# EAGLE design EIT sample circuit with shorter connectors (EAGLE 7.7.0)
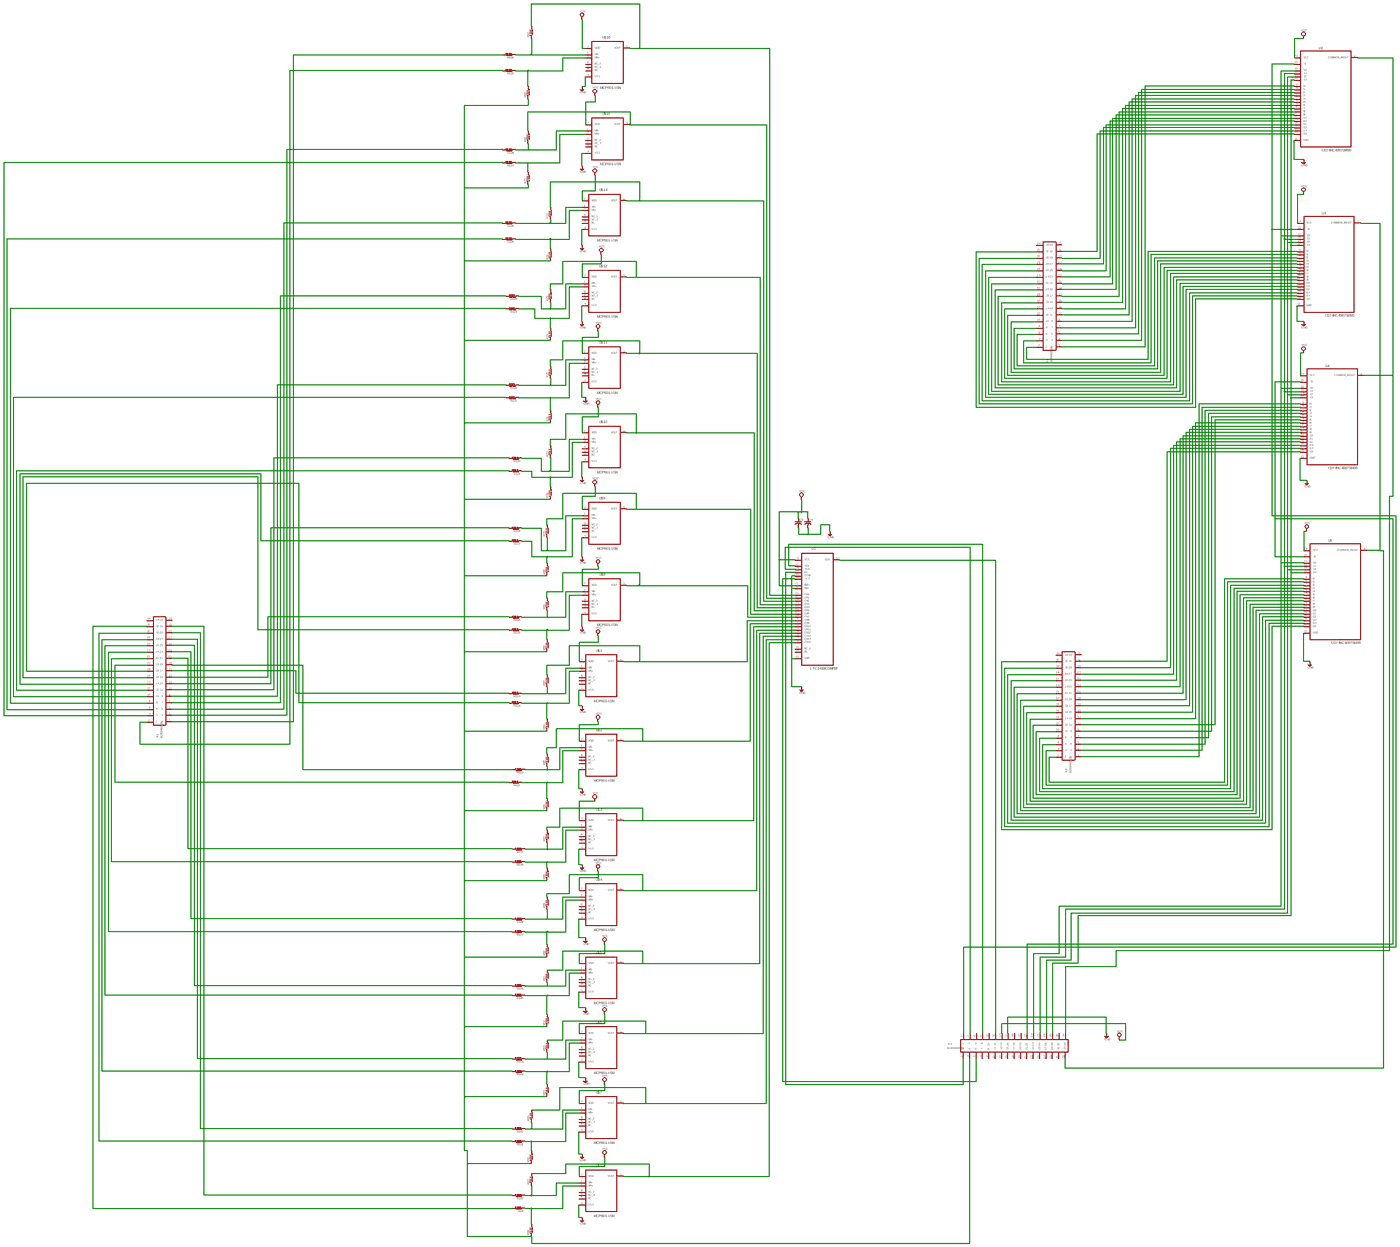
[diagram p0: schematic, sheet 1, overview]
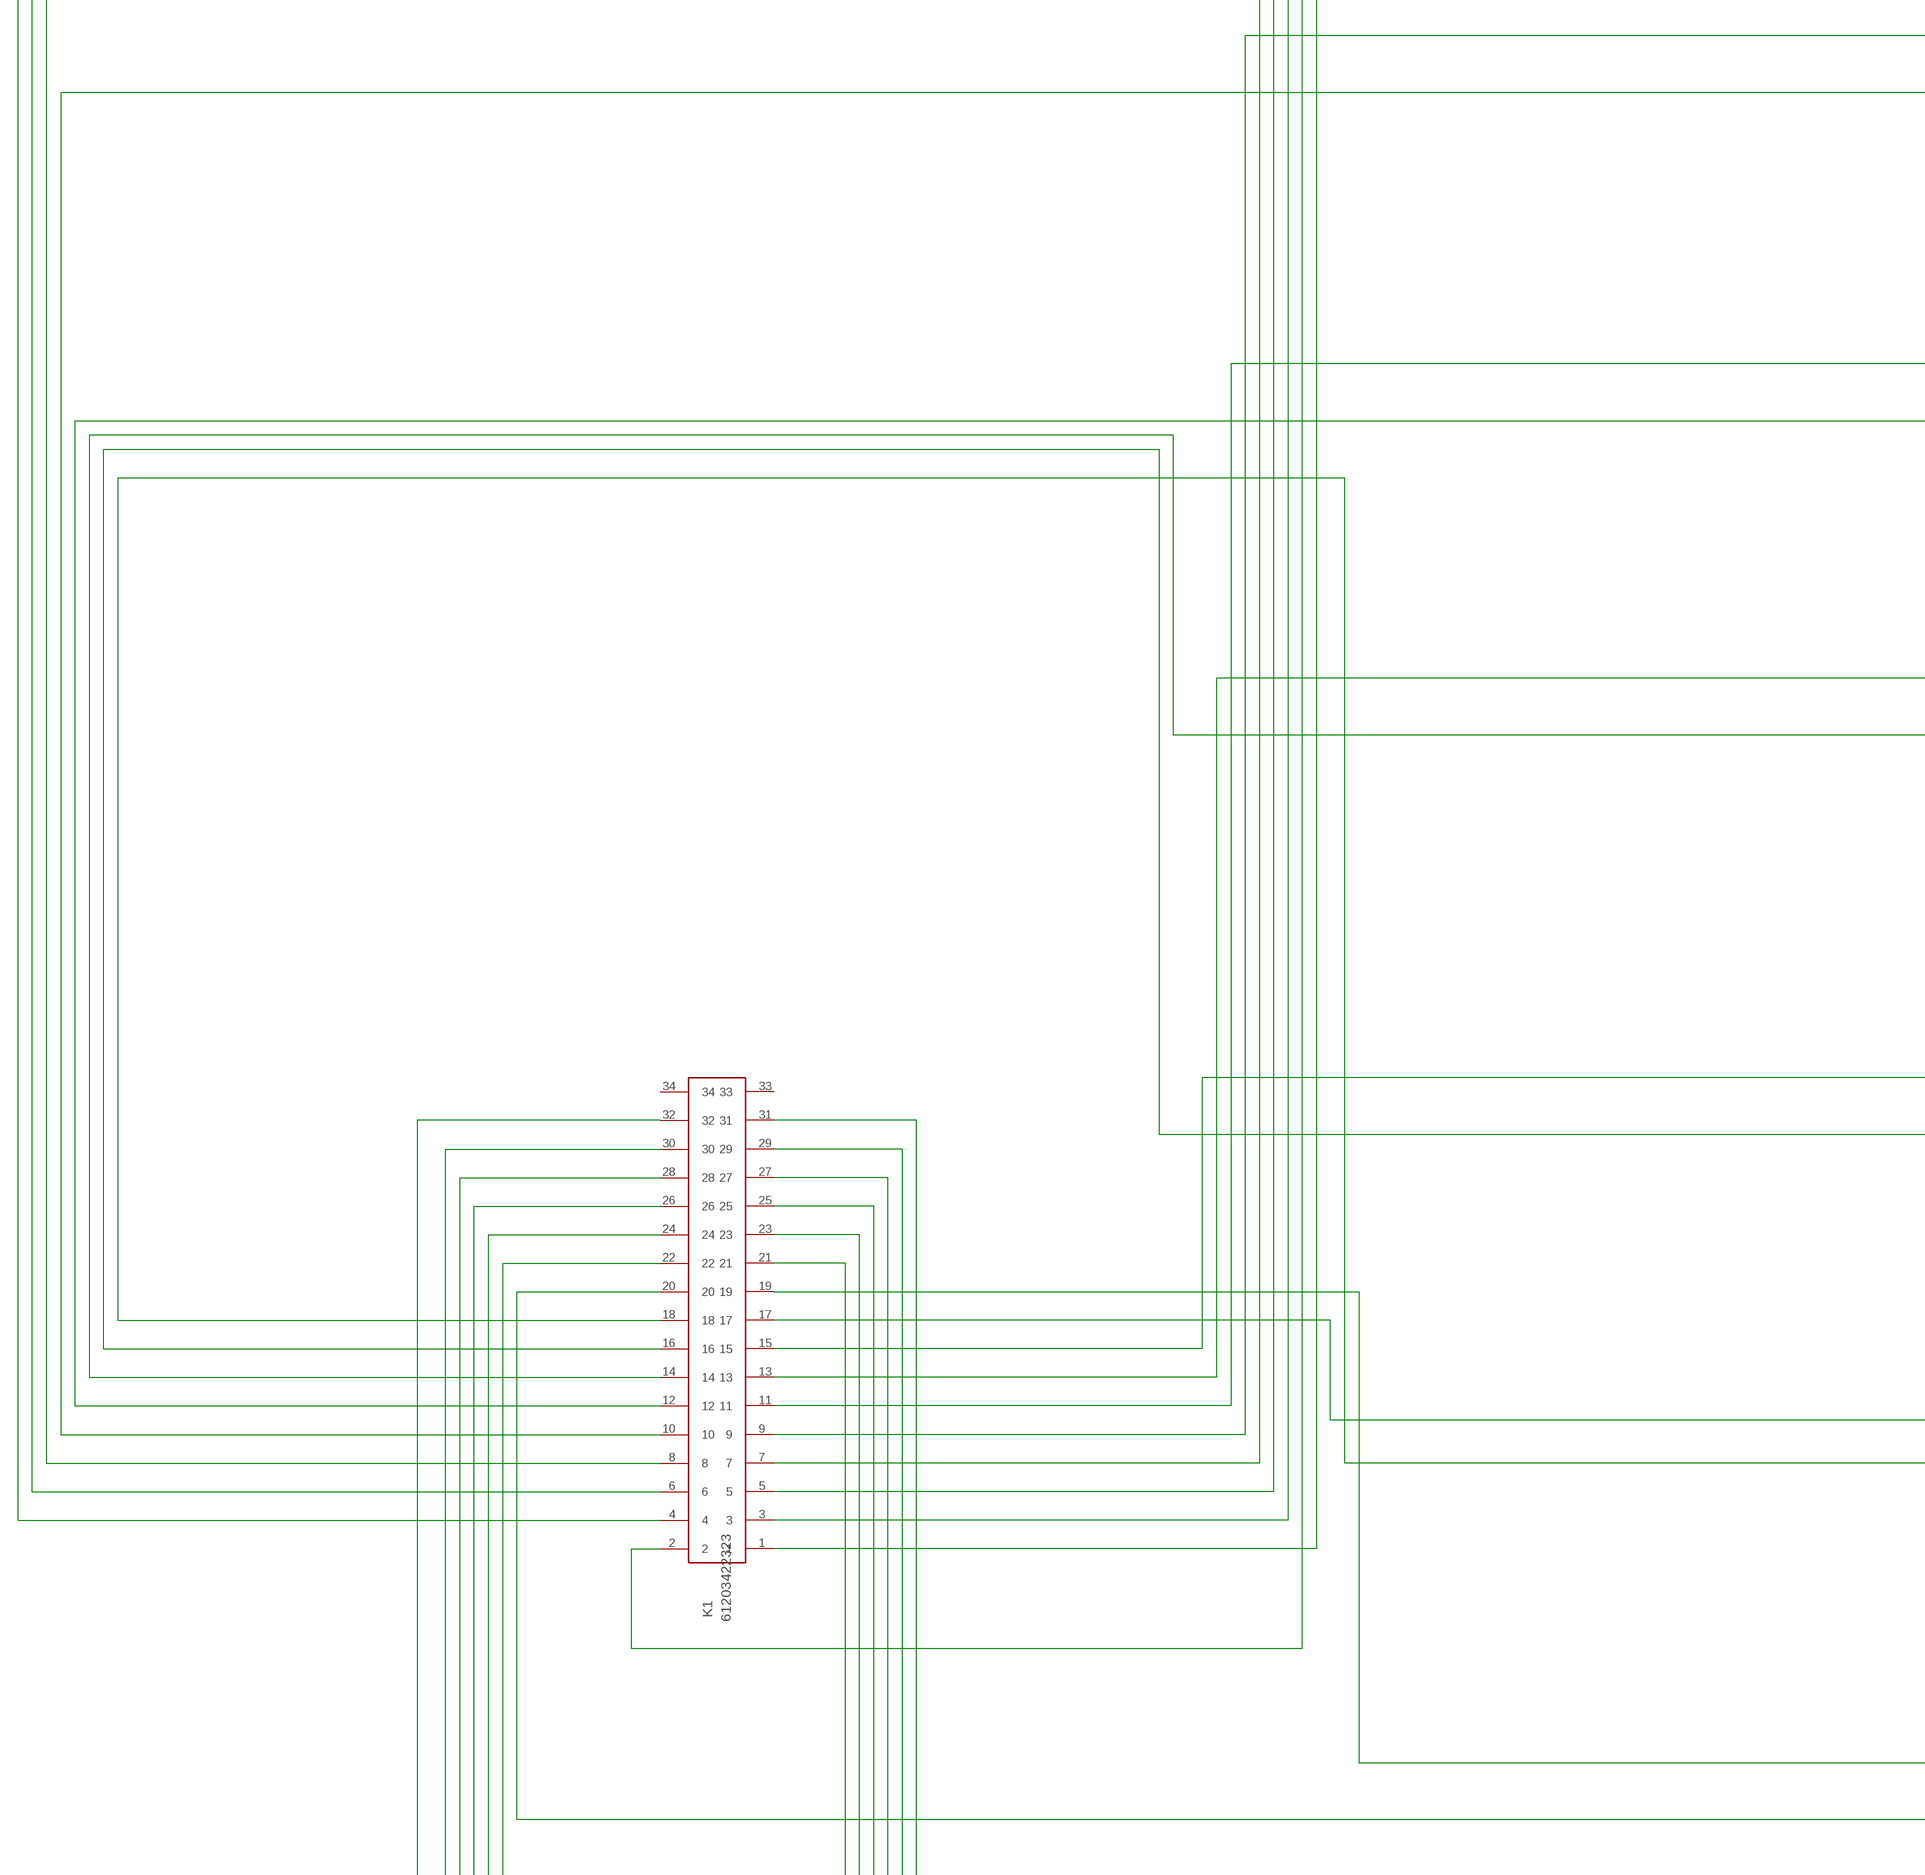
[diagram p1: schematic, sheet 1, part 1 of 7]
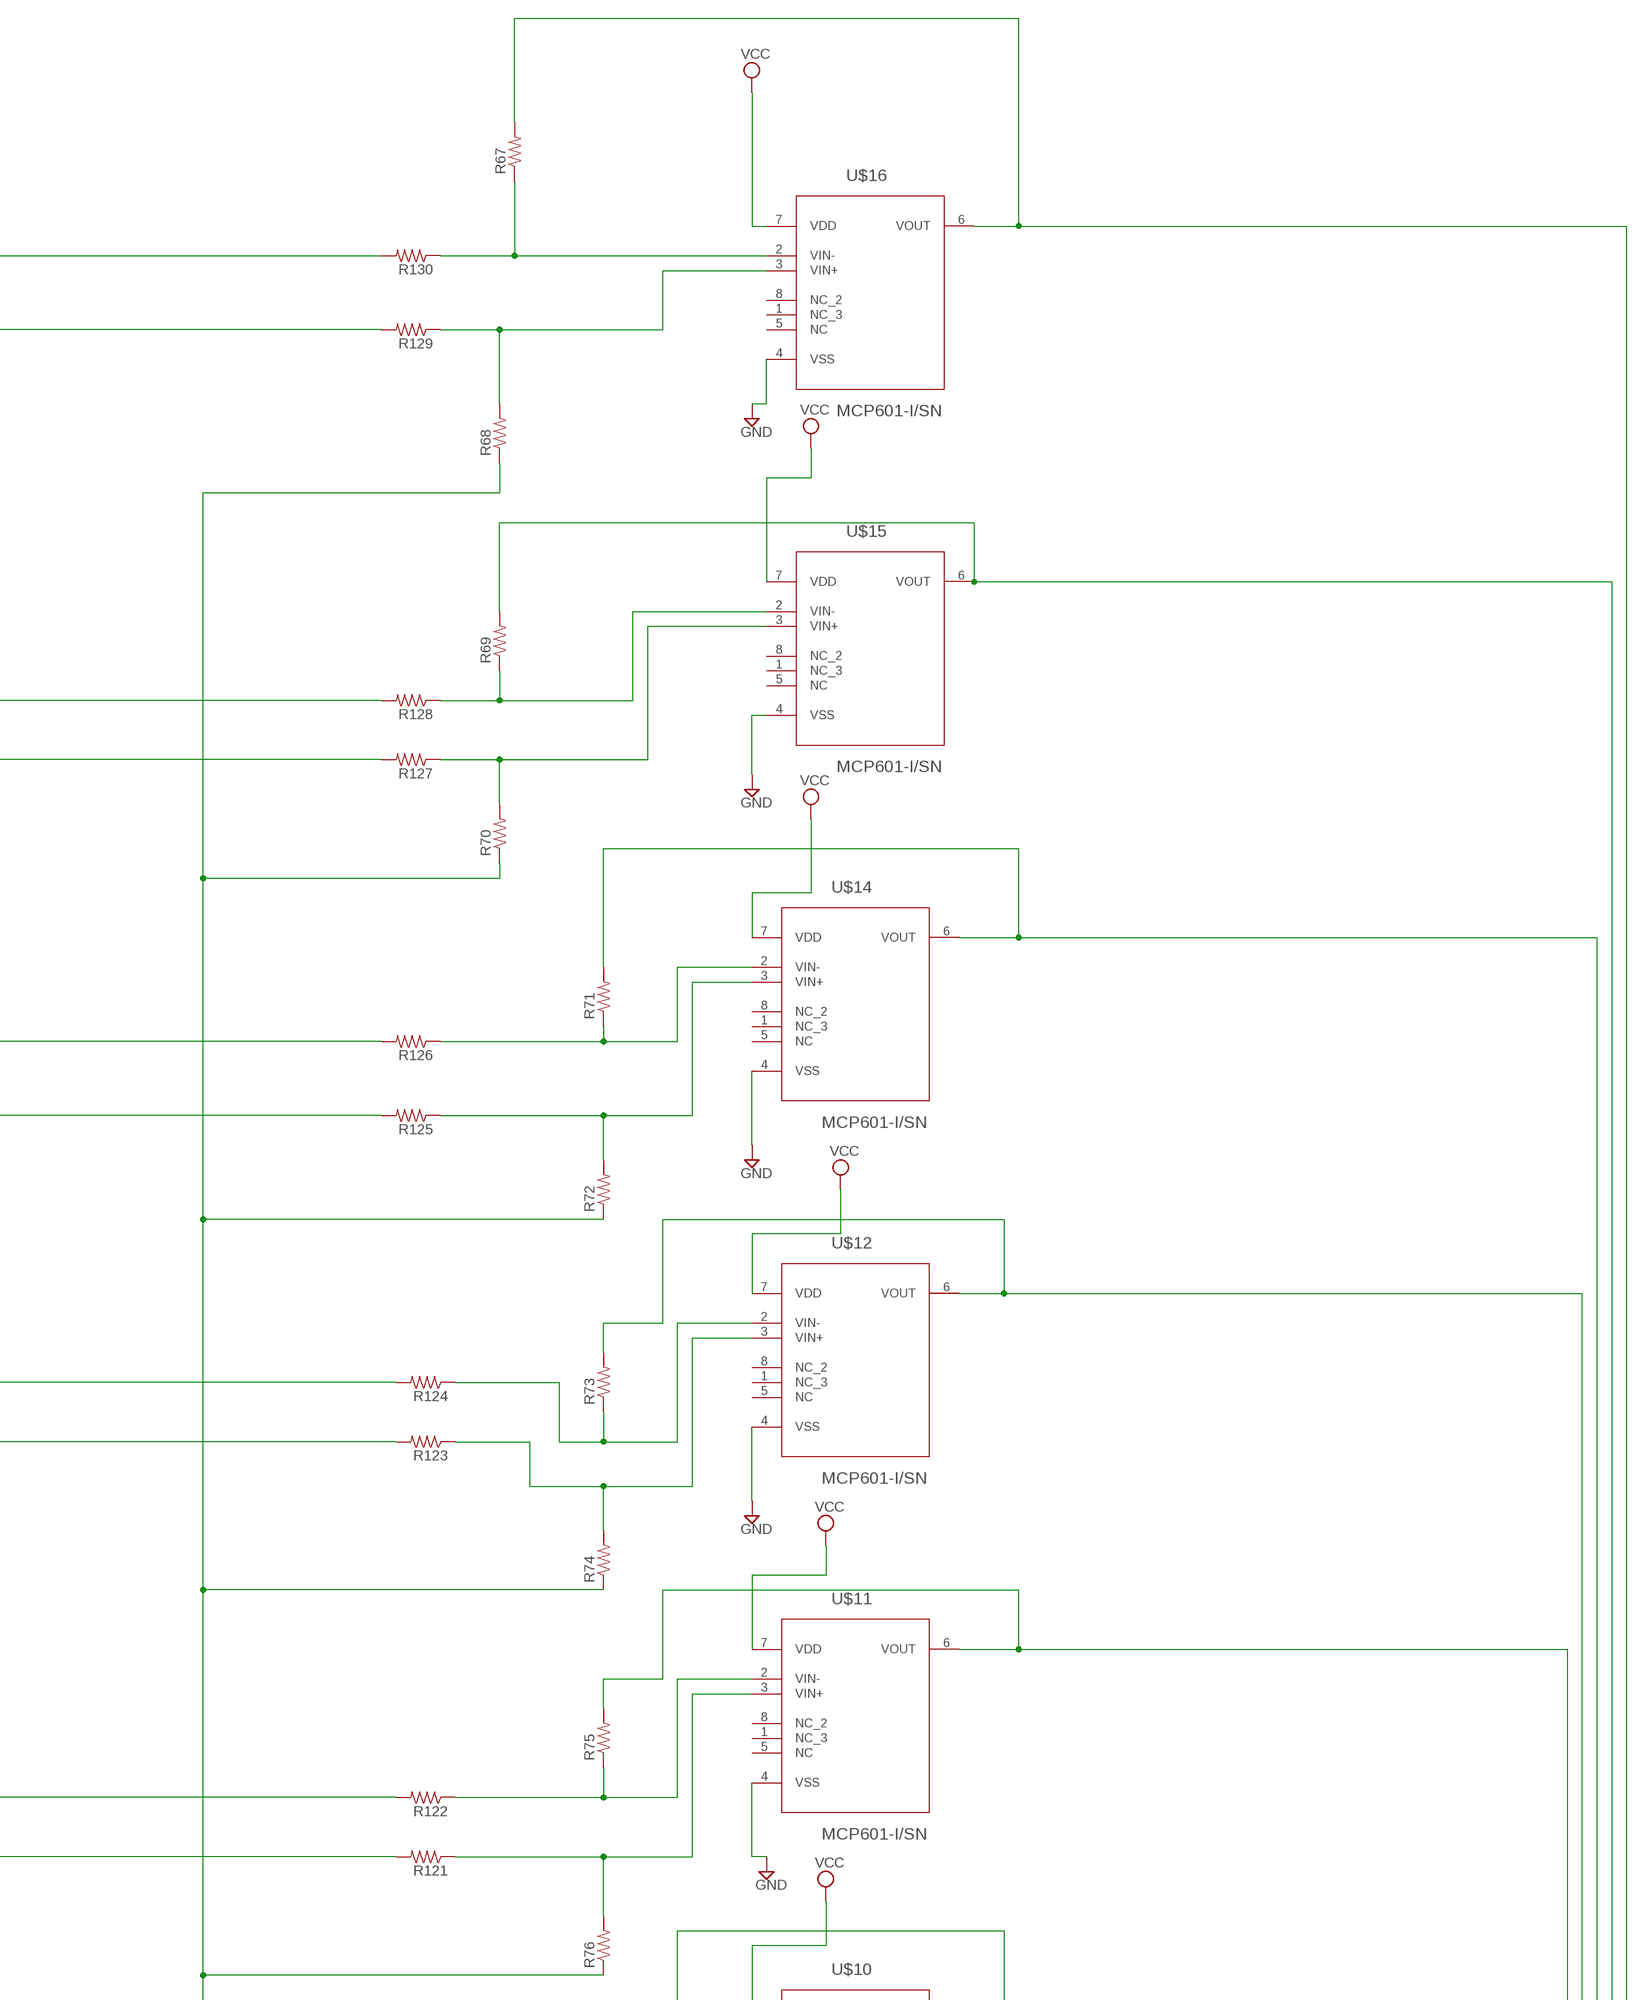
[diagram p2: schematic, sheet 1, part 2 of 7]
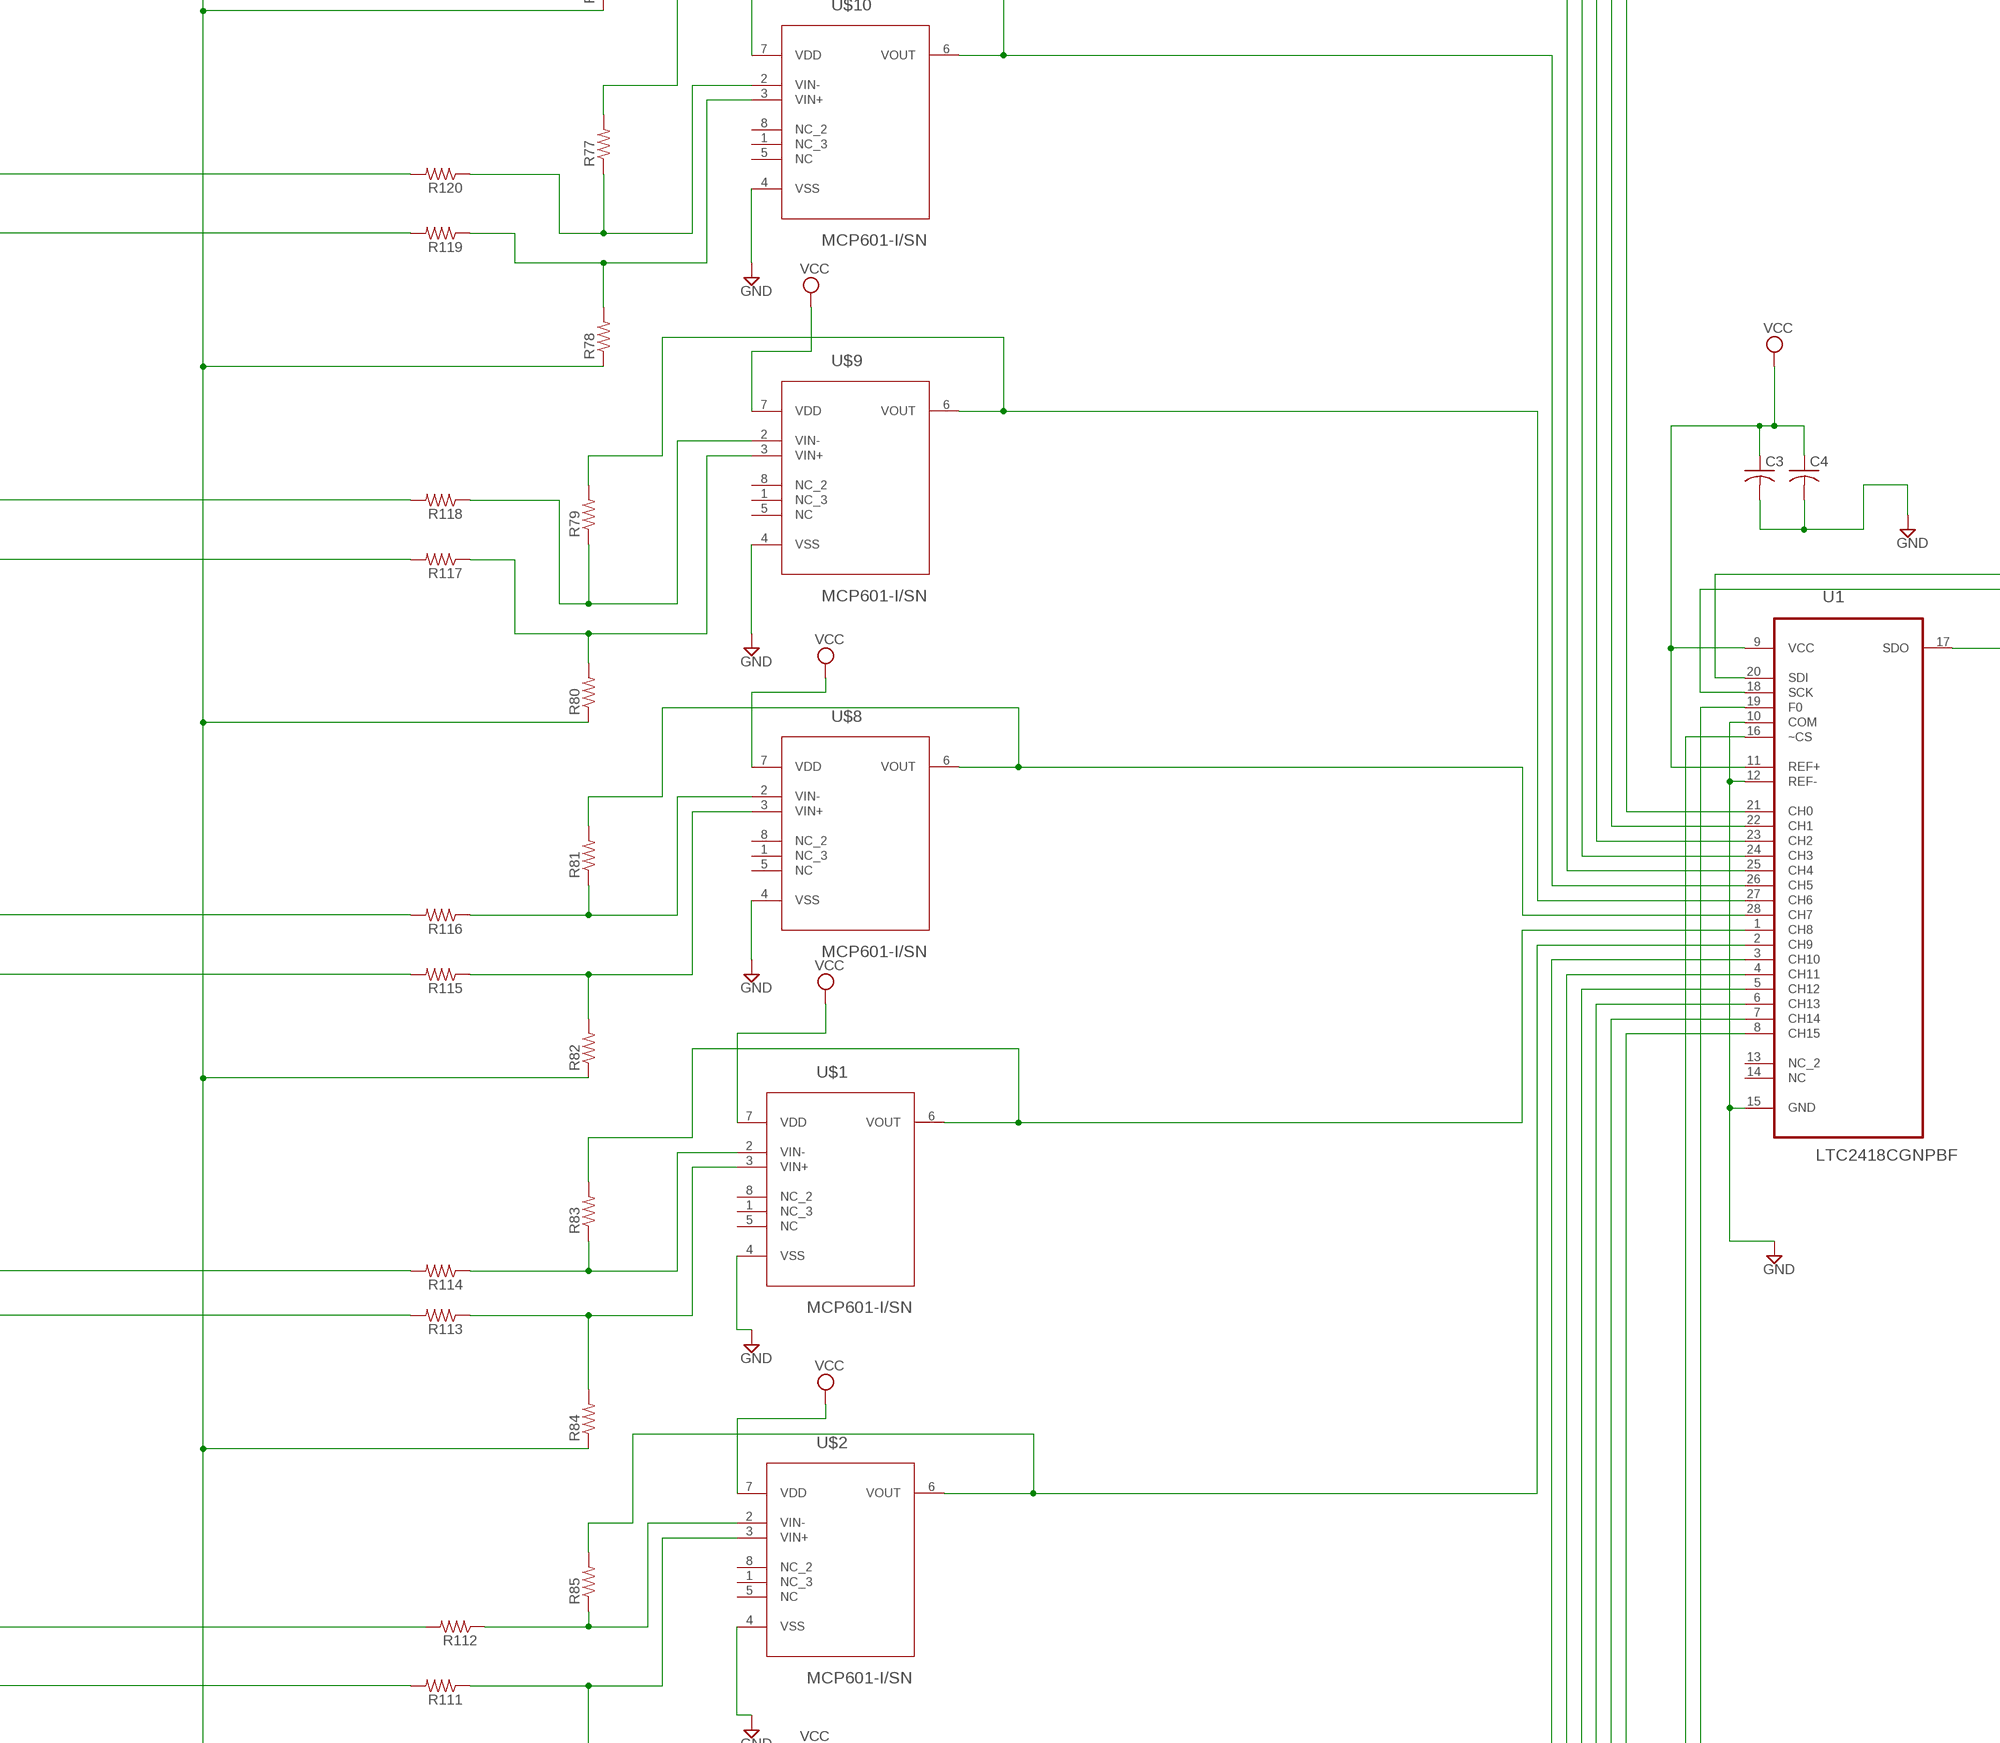
[diagram p3: schematic, sheet 1, part 3 of 7]
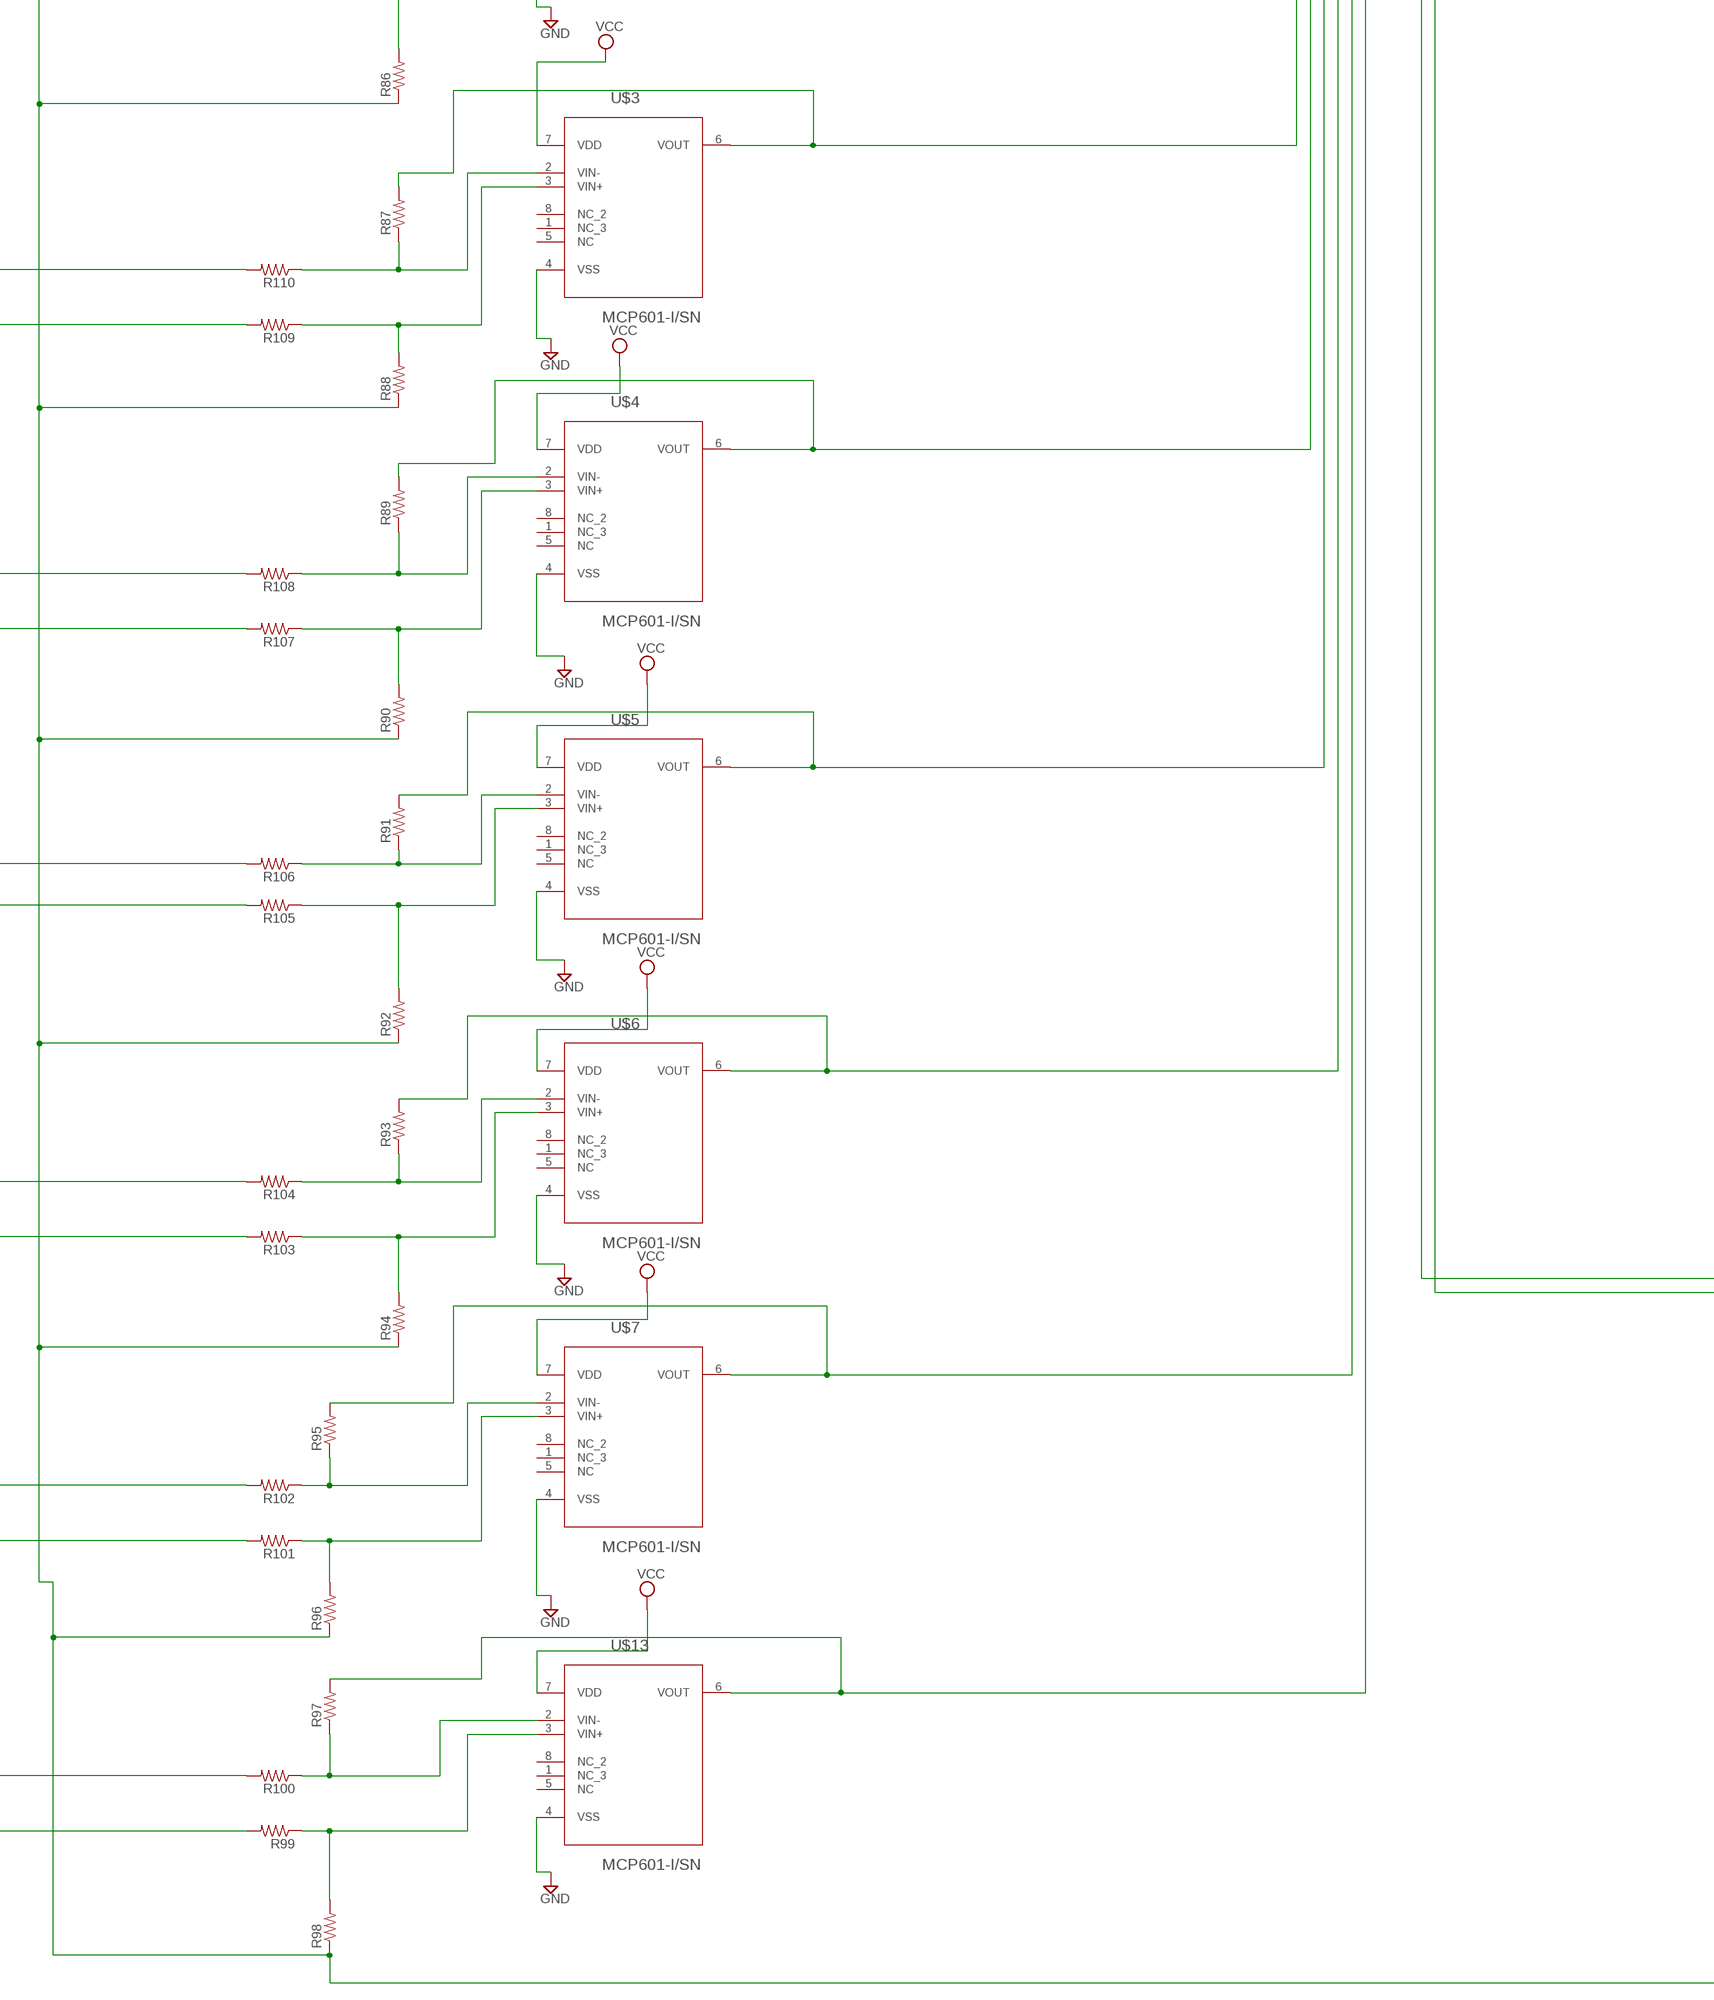
[diagram p4: schematic, sheet 1, part 4 of 7]
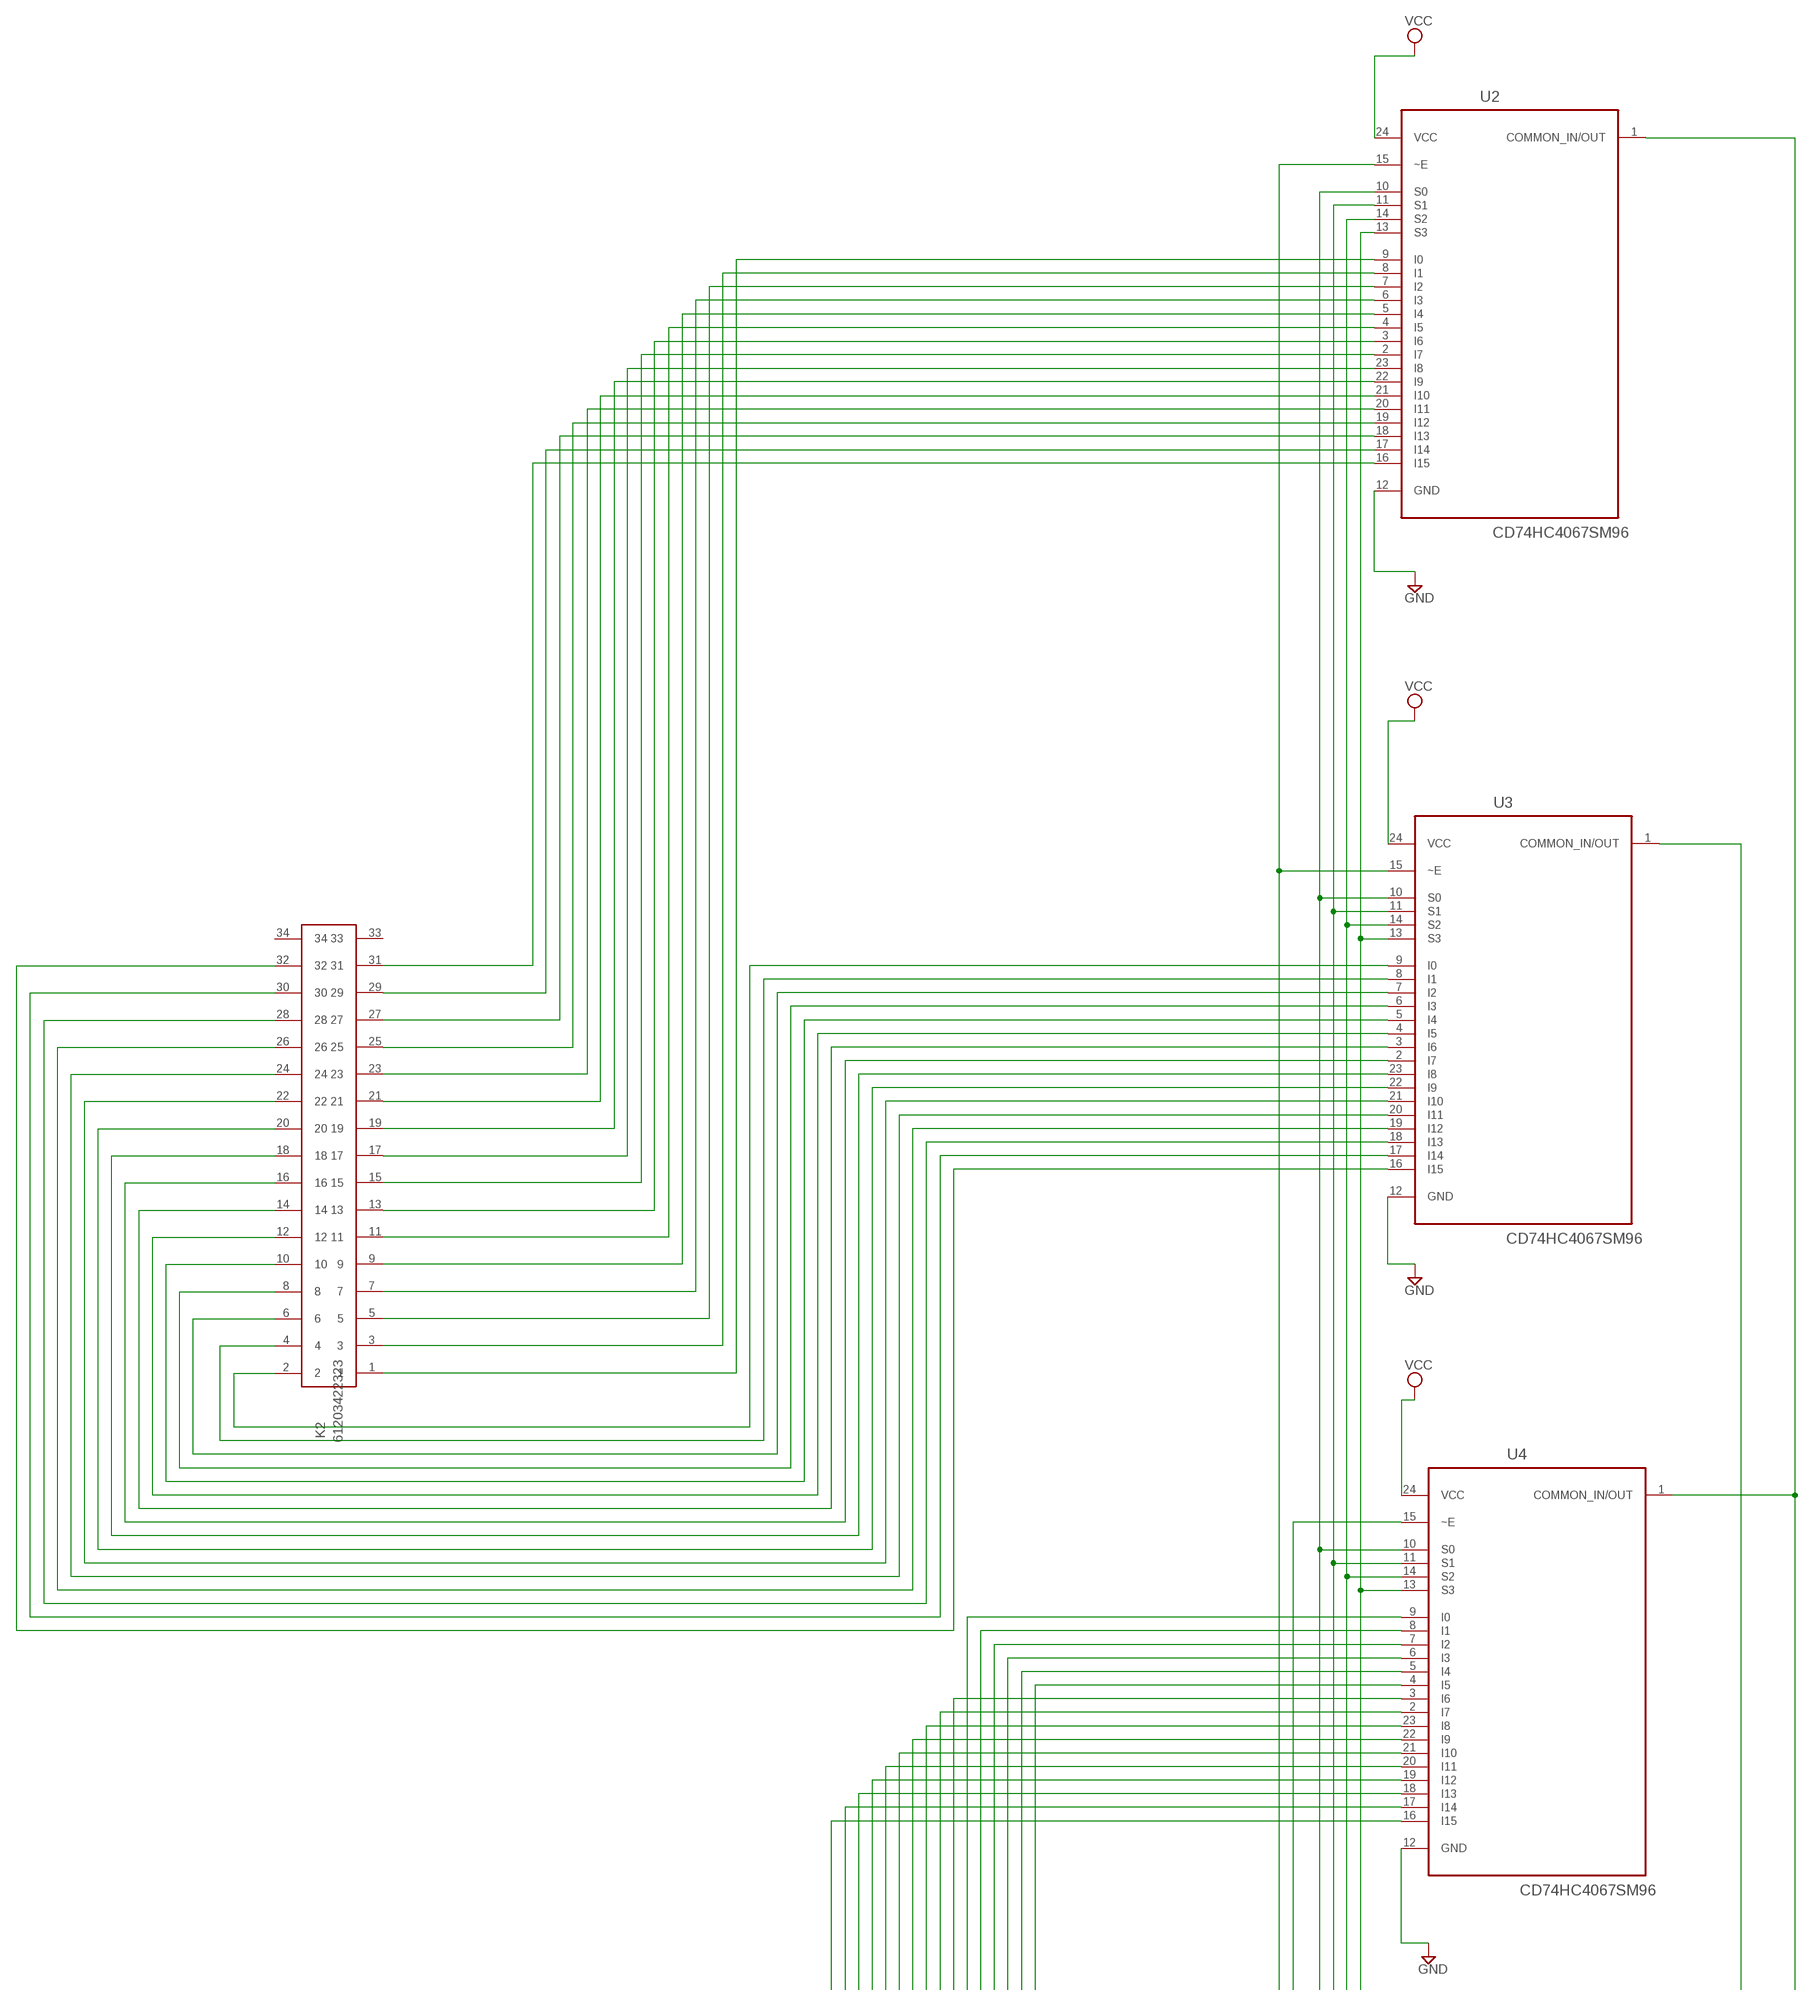
[diagram p5: schematic, sheet 1, part 5 of 7]
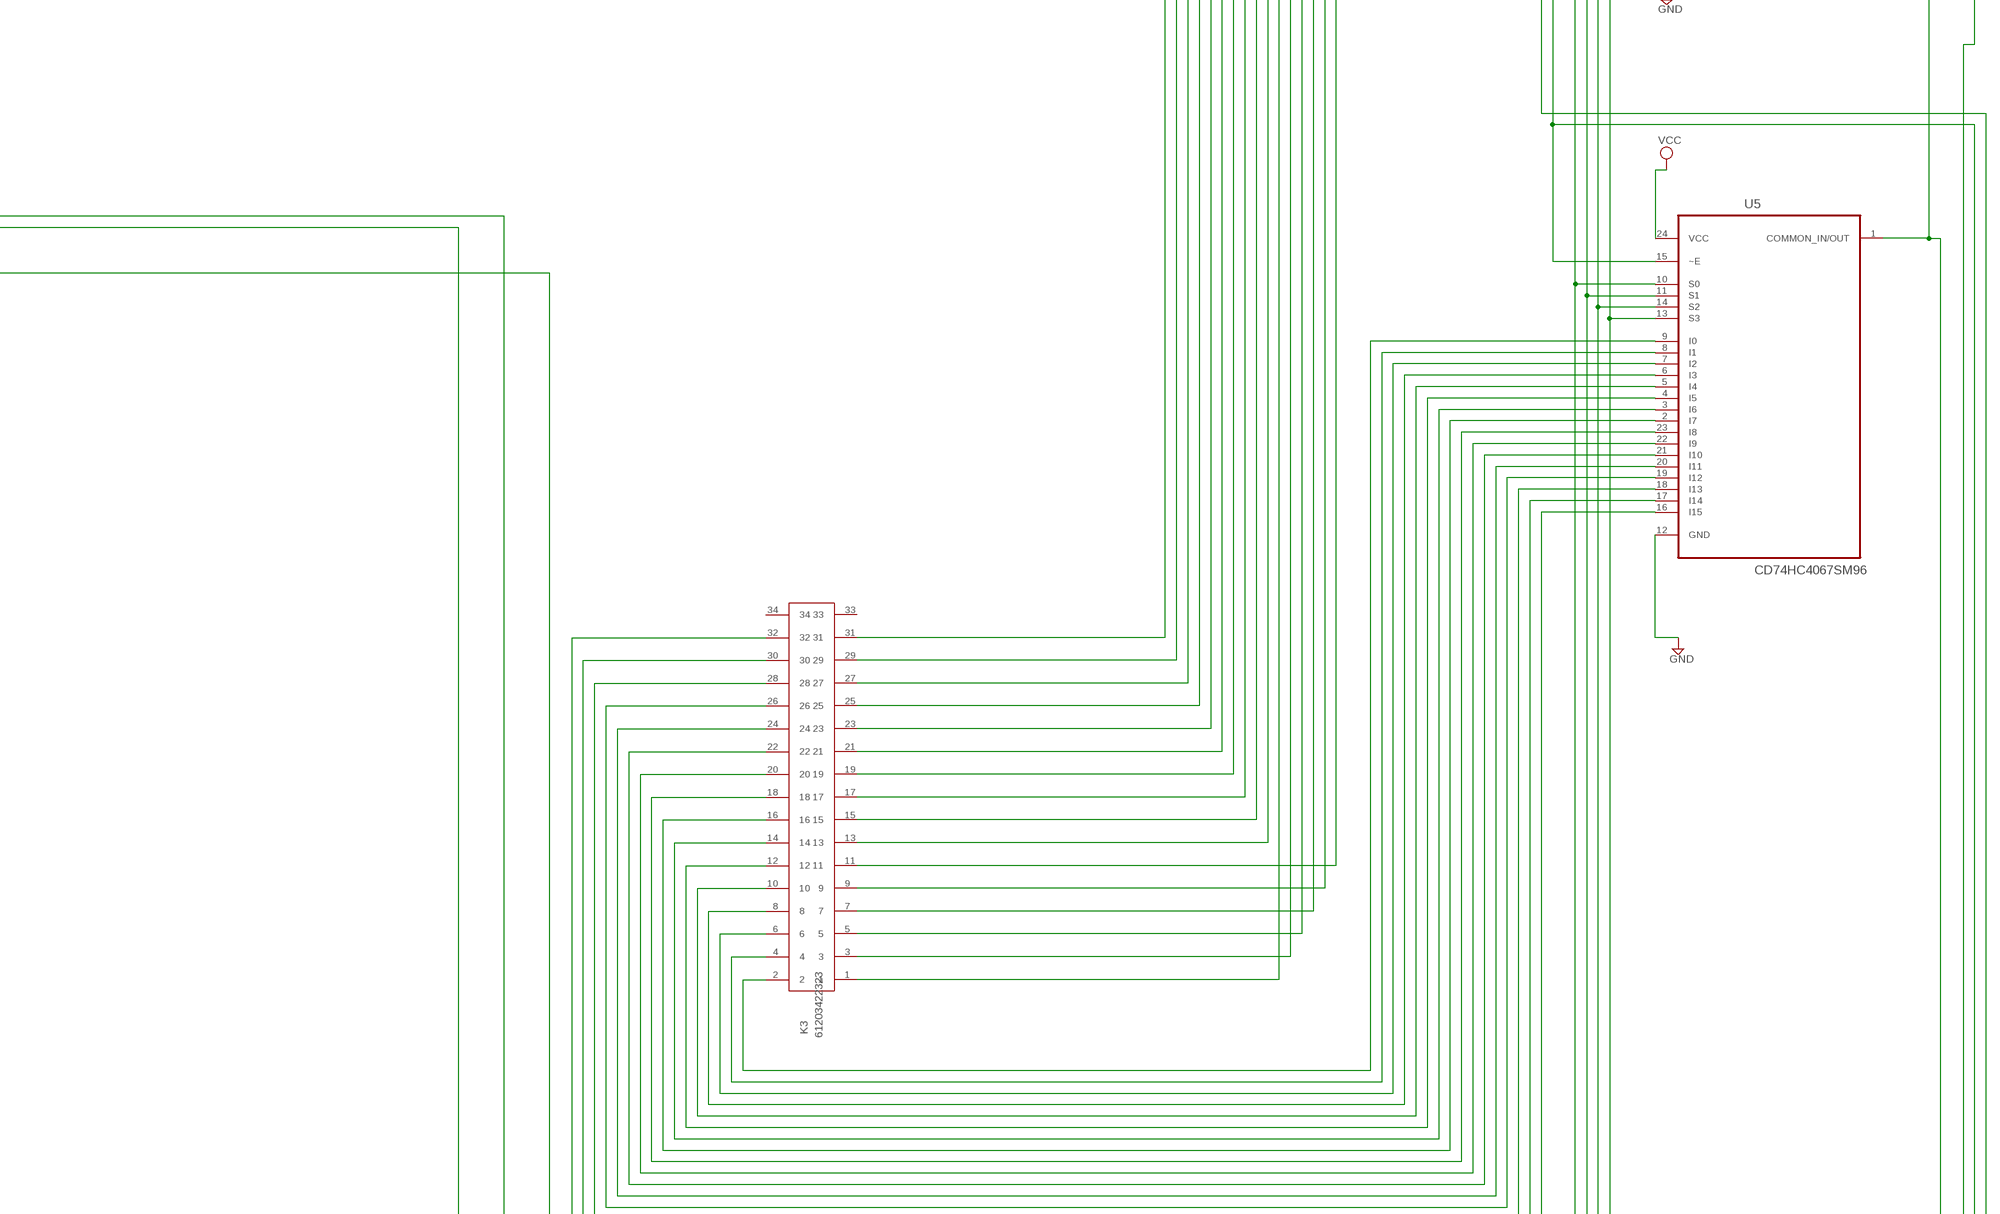
[diagram p6: schematic, sheet 1, part 6 of 7]
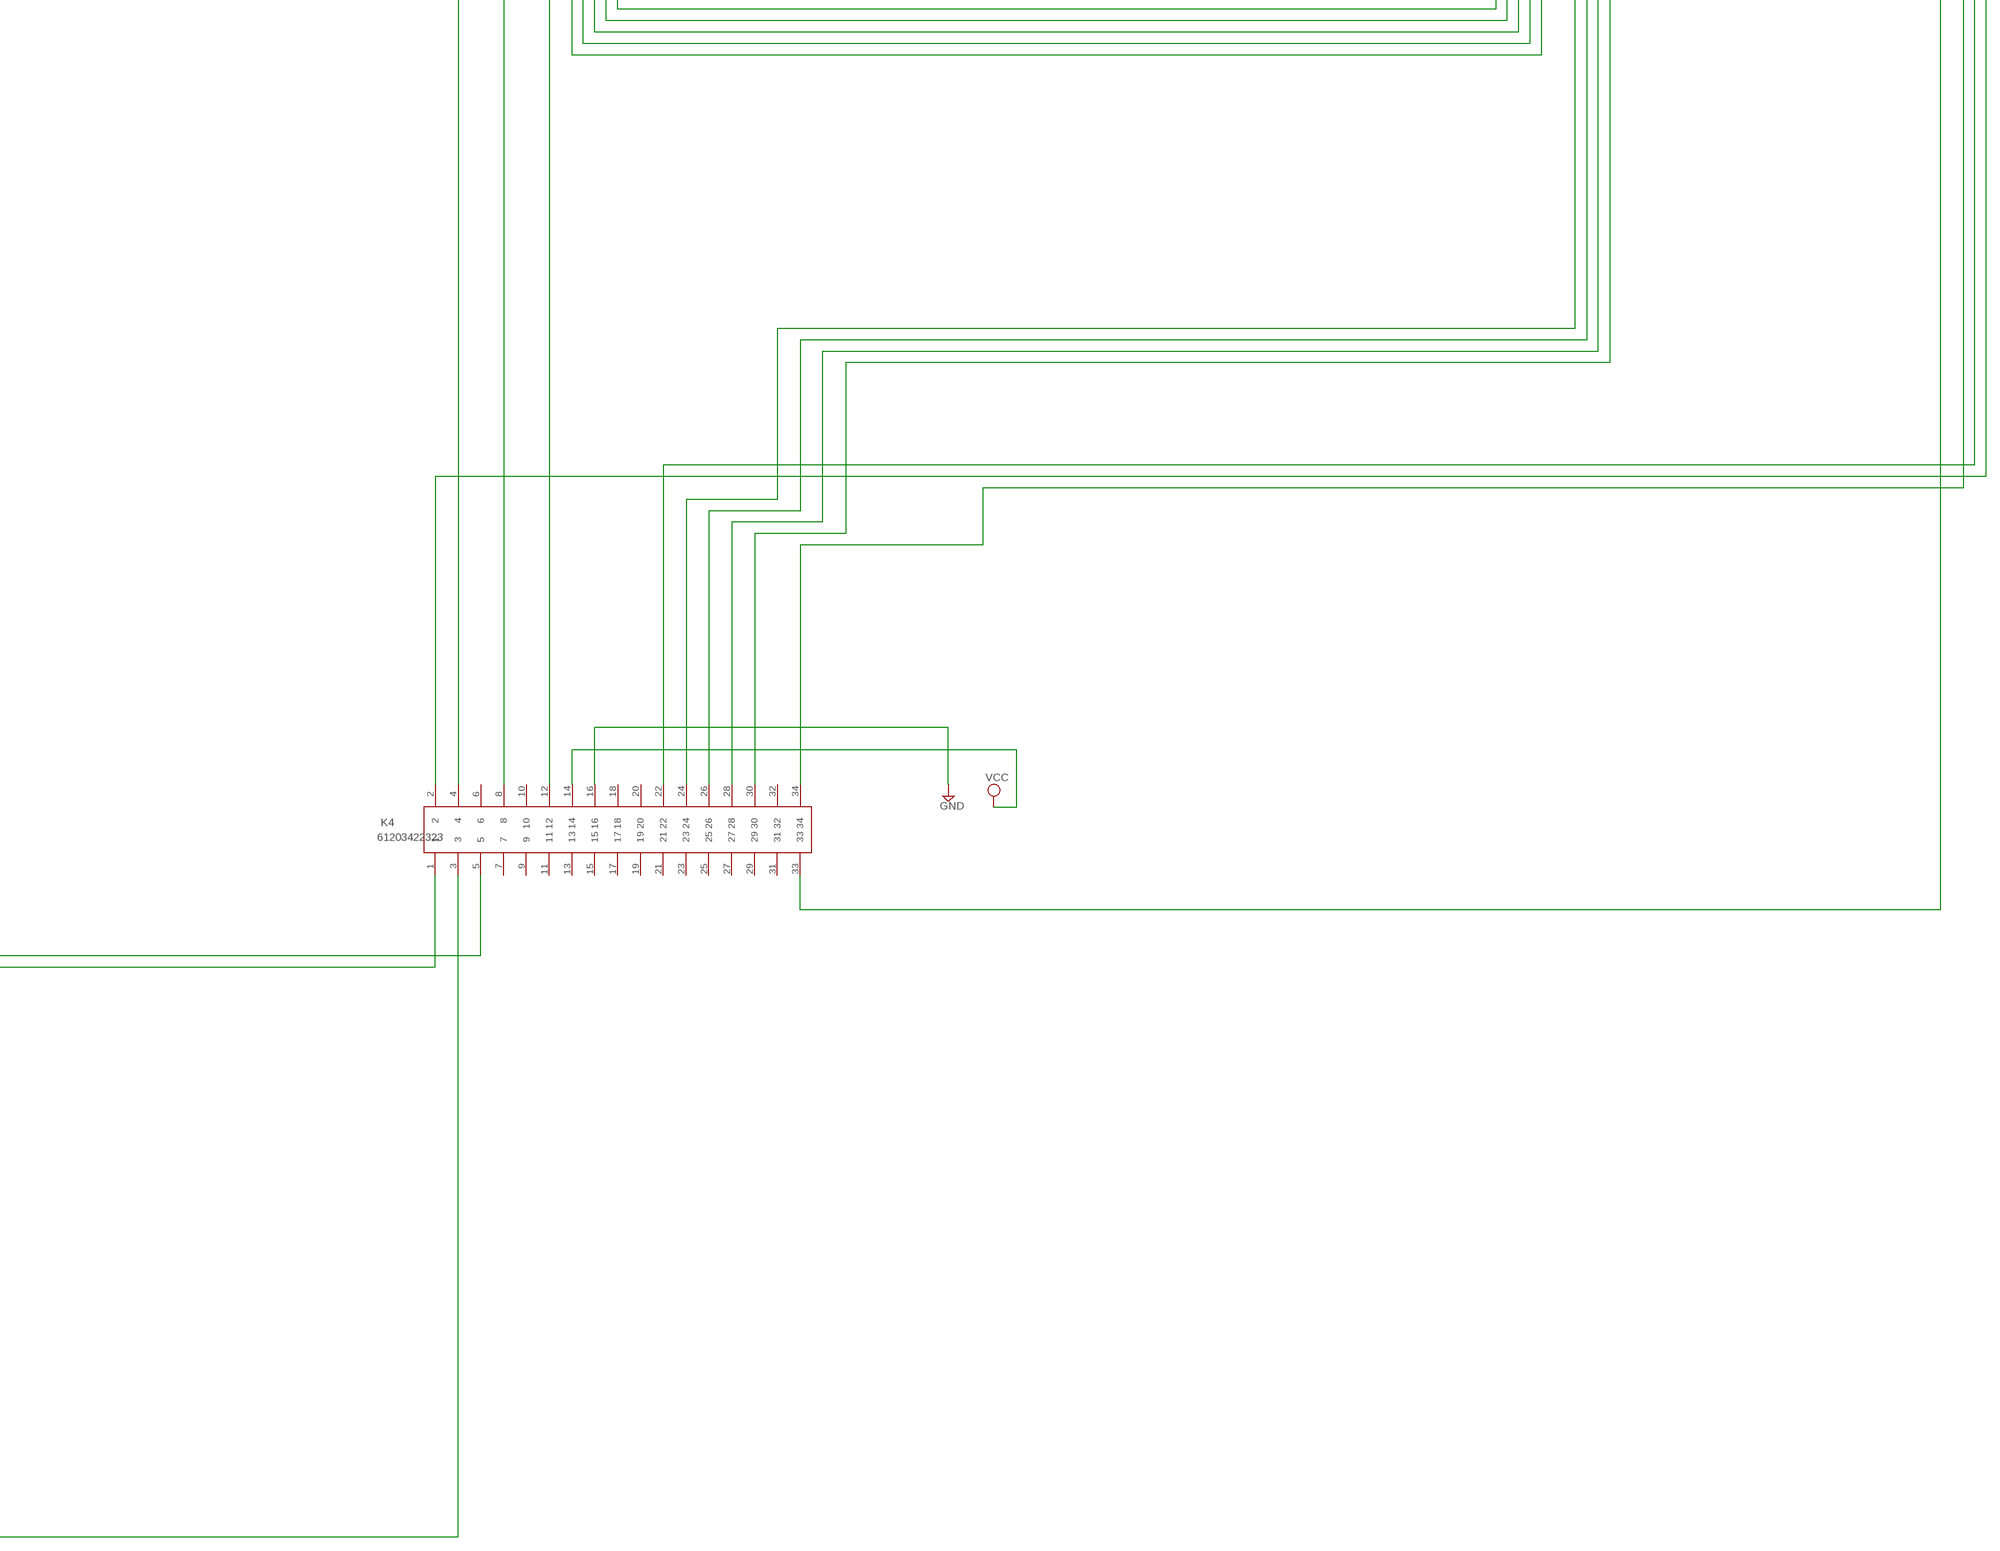
[diagram p7: schematic, sheet 1, part 7 of 7]

## Parts
C3  C-US050-030X075  [C050-030X075]
C4  C-US050-030X075  [C050-030X075]
K1  61203422323  [61203422323]
K2  61203422323  [61203422323]
K3  61203422323  [61203422323]
K4  61203422323  [61203422323]
R67  R-US_0207/10  [0207/10]
R68  R-US_0207/10  [0207/10]
R69  R-US_0207/10  [0207/10]
R70  R-US_0207/10  [0207/10]
R71  R-US_0207/10  [0207/10]
R72  R-US_0207/10  [0207/10]
R73  R-US_0207/10  [0207/10]
R74  R-US_0207/10  [0207/10]
R75  R-US_0207/10  [0207/10]
R76  R-US_0207/10  [0207/10]
R77  R-US_0207/10  [0207/10]
R78  R-US_0207/10  [0207/10]
R79  R-US_0207/10  [0207/10]
R80  R-US_0207/10  [0207/10]
R81  R-US_0207/10  [0207/10]
R82  R-US_0207/10  [0207/10]
R83  R-US_0207/10  [0207/10]
R84  R-US_0207/10  [0207/10]
R85  R-US_0207/10  [0207/10]
R86  R-US_0207/10  [0207/10]
R87  R-US_0207/10  [0207/10]
R88  R-US_0207/10  [0207/10]
R89  R-US_0207/10  [0207/10]
R90  R-US_0207/10  [0207/10]
R91  R-US_0207/10  [0207/10]
R92  R-US_0207/10  [0207/10]
R93  R-US_0207/10  [0207/10]
R94  R-US_0207/10  [0207/10]
R95  R-US_0207/10  [0207/10]
R96  R-US_0207/10  [0207/10]
R97  R-US_0207/10  [0207/10]
R98  R-US_0207/10  [0207/10]
R99  R-US_0207/7  [0207/7]
R100  R-US_0207/7  [0207/7]
R101  R-US_0207/7  [0207/7]
R102  R-US_0207/7  [0207/7]
R103  R-US_0207/7  [0207/7]
R104  R-US_0207/7  [0207/7]
R105  R-US_0207/7  [0207/7]
R106  R-US_0207/7  [0207/7]
R107  R-US_0207/7  [0207/7]
R108  R-US_0207/7  [0207/7]
R109  R-US_0207/7  [0207/7]
R110  R-US_0207/7  [0207/7]
R111  R-US_0207/7  [0207/7]
R112  R-US_0207/7  [0207/7]
R113  R-US_0207/7  [0207/7]
R114  R-US_0207/7  [0207/7]
R115  R-US_0207/7  [0207/7]
R116  R-US_0207/7  [0207/7]
R117  R-US_0207/7  [0207/7]
R118  R-US_0207/7  [0207/7]
R119  R-US_0207/7  [0207/7]
R120  R-US_0207/7  [0207/7]
R121  R-US_0207/7  [0207/7]
R122  R-US_0207/7  [0207/7]
R123  R-US_0207/7  [0207/7]
R124  R-US_0207/7  [0207/7]
R125  R-US_0207/7  [0207/7]
R126  R-US_0207/7  [0207/7]
R127  R-US_0207/7  [0207/7]
R128  R-US_0207/7  [0207/7]
R129  R-US_0207/7  [0207/7]
R130  R-US_0207/7  [0207/7]
U1  LTC2418CGNPBF  [SOP63P600X175-28N]
U2  CD74HC4067SM96  [SOP65P780X200-24N]
U3  CD74HC4067SM96  [SOP65P780X200-24N]
U4  CD74HC4067SM96  [SOP65P780X200-24N]
U5  CD74HC4067SM96  [SOP65P780X200-24N]
U$1  MCP601-I/SN  [SOIC127P600X175-8N]
U$2  MCP601-I/SN  [SOIC127P600X175-8N]
U$3  MCP601-I/SN  [SOIC127P600X175-8N]
U$4  MCP601-I/SN  [SOIC127P600X175-8N]
U$5  MCP601-I/SN  [SOIC127P600X175-8N]
U$6  MCP601-I/SN  [SOIC127P600X175-8N]
U$7  MCP601-I/SN  [SOIC127P600X175-8N]
U$8  MCP601-I/SN  [SOIC127P600X175-8N]
U$9  MCP601-I/SN  [SOIC127P600X175-8N]
U$10  MCP601-I/SN  [SOIC127P600X175-8N]
U$11  MCP601-I/SN  [SOIC127P600X175-8N]
U$12  MCP601-I/SN  [SOIC127P600X175-8N]
U$13  MCP601-I/SN  [SOIC127P600X175-8N]
U$14  MCP601-I/SN  [SOIC127P600X175-8N]
U$15  MCP601-I/SN  [SOIC127P600X175-8N]
U$16  MCP601-I/SN  [SOIC127P600X175-8N]

## Nets
GND: C3.2 C4.2 K4.16 U1.10(COM) U1.12(REF-) U1.15(GND) U2.12(GND) U3.12(GND) U4.12(GND) U5.12(GND) U$1.4(VSS) U$2.4(VSS) U$3.4(VSS) U$4.4(VSS) U$5.4(VSS) U$6.4(VSS) U$7.4(VSS) U$8.4(VSS) U$9.4(VSS) U$10.4(VSS) U$11.4(VSS) U$12.4(VSS) U$13.4(VSS) U$14.4(VSS) U$15.4(VSS) U$16.4(VSS)
N$1: R67.2 U1.21(CH0) U$16.6(VOUT)
N$3: R71.2 U1.23(CH2) U$14.6(VOUT)
N$4: R73.2 U1.24(CH3) U$12.6(VOUT)
N$5: R75.2 U1.25(CH4) U$11.6(VOUT)
N$6: R77.2 U1.26(CH5) U$10.6(VOUT)
N$7: R79.2 U1.27(CH6) U$9.6(VOUT)
N$8: R81.2 U1.28(CH7) U$8.6(VOUT)
N$9: R83.2 U1.1(CH8) U$1.6(VOUT)
N$10: R85.2 U1.2(CH9) U$2.6(VOUT)
N$11: R87.2 U1.3(CH10) U$3.6(VOUT)
N$12: R89.2 U1.4(CH11) U$4.6(VOUT)
N$13: R91.2 U1.5(CH12) U$5.6(VOUT)
N$14: R93.2 U1.6(CH13) U$6.6(VOUT)
N$15: R95.2 U1.7(CH14) U$7.6(VOUT)
N$16: R97.2 U1.8(CH15) U$13.6(VOUT)
N$17: K4.3 R68.1 R70.1 R72.1 R74.1 R76.1 R78.1 R80.1 R82.1 R84.1 R86.1 R88.1 R90.1 R92.1 R94.1 R96.1 R98.1
N$18: R94.2 R103.1 U$6.3(VIN+)
N$19: R92.2 R105.1 U$5.3(VIN+)
N$20: R67.1 R130.1 U$16.2(VIN-)
N$21: R90.2 R107.1 U$4.3(VIN+)
N$22: R68.2 R129.1 U$16.3(VIN+)
N$23: R88.2 R109.1 U$3.3(VIN+)
N$24: R69.1 R128.1 U$15.2(VIN-)
N$25: R70.2 R127.1 U$15.3(VIN+)
N$26: R86.2 R111.1 U$2.3(VIN+)
N$27: R71.1 R126.1 U$14.2(VIN-)
N$28: R84.2 R113.1 U$1.3(VIN+)
N$29: R82.2 R115.1 U$8.3(VIN+)
N$30: R73.1 R124.1 U$12.2(VIN-)
N$31: R80.2 R117.1 U$9.3(VIN+)
N$32: R75.1 R122.1 U$11.2(VIN-)
N$33: R78.2 R119.1 U$10.3(VIN+)
N$34: R77.1 R120.1 U$10.2(VIN-)
N$35: R76.2 R121.1 U$11.3(VIN+)
N$36: R79.1 R118.1 U$9.2(VIN-)
N$37: R74.2 R123.1 U$12.3(VIN+)
N$38: R81.1 R116.1 U$8.2(VIN-)
N$39: R72.2 R125.1 U$14.3(VIN+)
N$40: R83.1 R114.1 U$1.2(VIN-)
N$41: K1.2 R129.2
N$42: R85.1 R112.1 U$2.2(VIN-)
N$43: K1.1 R130.2
N$44: R87.1 R110.1 U$3.2(VIN-)
N$45: K1.4 R127.2
N$46: R89.1 R108.1 U$4.2(VIN-)
N$47: K1.3 R128.2
N$48: R91.1 R106.1 U$5.2(VIN-)
N$49: K1.6 R125.2
N$50: R93.1 R104.1 U$6.2(VIN-)
N$51: K1.5 R126.2
N$52: R95.1 R102.1 U$7.2(VIN-)
N$53: K1.8 R123.2
N$54: R97.1 R100.1 U$13.2(VIN-)
N$55: K1.7 R124.2
N$56: R98.2 R99.1 U$13.3(VIN+)
N$57: K1.10 R121.2
N$58: R96.2 R101.1 U$7.3(VIN+)
N$59: K1.9 R122.2
N$60: K1.12 R119.2
N$61: K1.11 R120.2
N$62: K1.14 R117.2
N$63: K1.19 R112.2
N$64: K1.16 R115.2
N$65: K1.15 R116.2
N$66: K1.18 R113.2
N$67: K1.17 R114.2
N$68: K1.20 R111.2
N$69: K4.1 U1.19(F0)
N$70: K1.22 R109.2
N$71: K1.21 R110.2
N$72: K1.24 R107.2
N$73: K1.26 R105.2
N$74: K1.25 R106.2
N$75: K1.23 R108.2
N$76: K1.28 R103.2
N$77: K1.27 R104.2
N$78: K1.30 R101.2
N$79: K1.29 R102.2
N$80: K1.32 R99.2
N$81: K1.31 R100.2
N$82: K2.1 U2.9(I0)
N$83: K2.2 U3.9(I0)
N$84: K2.3 U2.8(I1)
N$85: K2.4 U3.8(I1)
N$86: K2.5 U2.7(I2)
N$87: K2.6 U3.7(I2)
N$88: K2.7 U2.6(I3)
N$89: K2.8 U3.6(I3)
N$90: K2.9 U2.5(I4)
N$91: K2.10 U3.5(I4)
N$92: K2.12 U3.4(I5)
N$93: K2.14 U3.3(I6)
N$94: K2.16 U3.2(I7)
N$95: K2.18 U3.23(I8)
N$96: K2.20 U3.22(I9)
N$97: K2.22 U3.21(I10)
N$98: K2.24 U3.20(I11)
N$99: K2.26 U3.19(I12)
N$100: K2.28 U3.18(I13)
N$101: K2.30 U3.17(I14)
N$102: K2.32 U3.16(I15)
N$103: K2.11 U2.4(I5)
N$104: K2.13 U2.3(I6)
N$105: K2.15 U2.2(I7)
N$106: K2.17 U2.23(I8)
N$107: K2.19 U2.22(I9)
N$108: K2.21 U2.21(I10)
N$109: K2.23 U2.20(I11)
N$110: K2.25 U2.19(I12)
N$111: K2.27 U2.18(I13)
N$112: K2.29 U2.17(I14)
N$113: K2.31 U2.16(I15)
N$114: K3.1 U4.9(I0)
N$115: K3.3 U4.8(I1)
N$116: K3.5 U4.7(I2)
N$117: K3.7 U4.6(I3)
N$118: K3.9 U4.5(I4)
N$119: K3.11 U4.4(I5)
N$120: K3.13 U4.3(I6)
N$121: K3.15 U4.2(I7)
N$122: K3.17 U4.23(I8)
N$123: K3.19 U4.22(I9)
N$124: K3.21 U4.21(I10)
N$125: K3.23 U4.20(I11)
N$126: K3.25 U4.19(I12)
N$127: K3.27 U4.18(I13)
N$128: K3.29 U4.17(I14)
N$129: K3.31 U4.16(I15)
N$130: K3.2 U5.9(I0)
N$131: K3.4 U5.8(I1)
N$132: K3.6 U5.7(I2)
N$133: K3.8 U5.6(I3)
N$134: K3.10 U5.5(I4)
N$135: K3.12 U5.4(I5)
N$136: K3.14 U5.3(I6)
N$137: K3.16 U5.2(I7)
N$138: K3.18 U5.23(I8)
N$139: K3.20 U5.22(I9)
N$140: K3.22 U5.21(I10)
N$141: K3.24 U5.20(I11)
N$142: K3.26 U5.19(I12)
N$143: K3.28 U5.18(I13)
N$144: K3.30 U5.17(I14)
N$145: K3.32 U5.16(I15)
N$146: K4.5 U1.16(~CS)
N$147: K4.4 U1.18(SCK)
N$148: K4.8 U1.20(SDI)
N$149: K4.12 U1.17(SDO)
N$151: K4.28 U2.14(S2) U3.14(S2) U4.14(S2) U5.14(S2)
N$152: K4.2 U2.15(~E) U3.15(~E)
N$153: K1.13 R118.2
N$154: K4.22 U4.15(~E) U5.15(~E)
N$155: K4.26 U2.11(S1) U3.11(S1) U4.11(S1) U5.11(S1)
N$156: K4.30 U2.13(S3) U3.13(S3) U4.13(S3) U5.13(S3)
N$157: R69.2 U1.22(CH1) U$15.6(VOUT)
N$160: K4.34 U2.1(COMMON_IN/OUT) U4.1(COMMON_IN/OUT)
N$161: K4.33 U3.1(COMMON_IN/OUT) U5.1(COMMON_IN/OUT)
N$162: K4.24 U2.10(S0) U3.10(S0) U4.10(S0) U5.10(S0)
VCC: C3.1 C4.1 K4.14 U1.9(VCC) U1.11(REF+) U2.24(VCC) U3.24(VCC) U4.24(VCC) U5.24(VCC) U$1.7(VDD) U$2.7(VDD) U$3.7(VDD) U$4.7(VDD) U$5.7(VDD) U$6.7(VDD) U$7.7(VDD) U$8.7(VDD) U$9.7(VDD) U$10.7(VDD) U$11.7(VDD) U$12.7(VDD) U$13.7(VDD) U$14.7(VDD) U$15.7(VDD) U$16.7(VDD)
Unconnected: K1.33 K1.34 K2.33 K2.34 K3.33 K3.34 K4.6 K4.7 K4.9 K4.10 K4.11 K4.13 K4.15 K4.17 K4.18 K4.19 K4.20 K4.21 K4.23 K4.25 K4.27 K4.29 K4.31 K4.32 U1.13(NC_2) U1.14(NC) U$1.1(NC_3) U$1.5(NC) U$1.8(NC_2) U$2.1(NC_3) U$2.5(NC) U$2.8(NC_2) U$3.1(NC_3) U$3.5(NC) U$3.8(NC_2) U$4.1(NC_3) U$4.5(NC) U$4.8(NC_2) U$5.1(NC_3) U$5.5(NC) U$5.8(NC_2) U$6.1(NC_3) U$6.5(NC) U$6.8(NC_2) U$7.1(NC_3) U$7.5(NC) U$7.8(NC_2) U$8.1(NC_3) U$8.5(NC) U$8.8(NC_2) U$9.1(NC_3) U$9.5(NC) U$9.8(NC_2) U$10.1(NC_3) U$10.5(NC) U$10.8(NC_2) U$11.1(NC_3) U$11.5(NC) U$11.8(NC_2) U$12.1(NC_3) U$12.5(NC) U$12.8(NC_2) U$13.1(NC_3) U$13.5(NC) U$13.8(NC_2) U$14.1(NC_3) U$14.5(NC) U$14.8(NC_2) U$15.1(NC_3) U$15.5(NC) U$15.8(NC_2) U$16.1(NC_3) U$16.5(NC) U$16.8(NC_2)

## Library data of the parts
C3 C4 = rcl:C-US: CAPACITOR, American symbol
K1-K4 = Wire_to_Board_Connectors_rev15d:61203422323: WR-BHD 2.54mm Board to Cable Transition Connector, 34 Pins=>Code : Con_WTB_IDC_61203422323 <http://katalog.we-online.de/media/thumbs2/eican/thb_Con_WTB_IDC_6120xx22323_pf2.jpg> Details see: http://katalog.we-online.de/en/em/612_0xx_223_23 Created 2014-06-05, Karrer Zheng 2014 (C) Würth Elektronik
R67-R130 = rcl:R-US_: RESISTOR, American symbol
U1 = LTC_By_element14_Batch_1:LTC2418CGNPBF: ADC; MPN: LTC2418CGN#PBF; OC_FARNELL: 1503408; OC_NEWARK: 56M5504; PACKAGE: SSOP-28; SUPPLIER: Linear Technology
U2-U5 = Texas Instruments_By_element14_Batch_1:CD74HC4067SM96: 16-Channel Analog Multiplexer/Demultiplexer; MPN: CD74HC4067SM96; OC_FARNELL: 1601157; OC_NEWARK: 13N4201; PACKAGE: SOP-24; SUPPLIER: TEXAS INSTRUMENTS
U$1-U$16 = Microchip_By_element14_Batch_1:MCP601-I/SN: CMOS Op Amp; DESCRIPTION: CMOS Op Amps; MPN: MCP601-I/SN; OC_FARNELL: 9758623; OC_NEWARK: 61K2952; PACKAGE: SOIC-8; SUPPLIER: Microchip

## Board
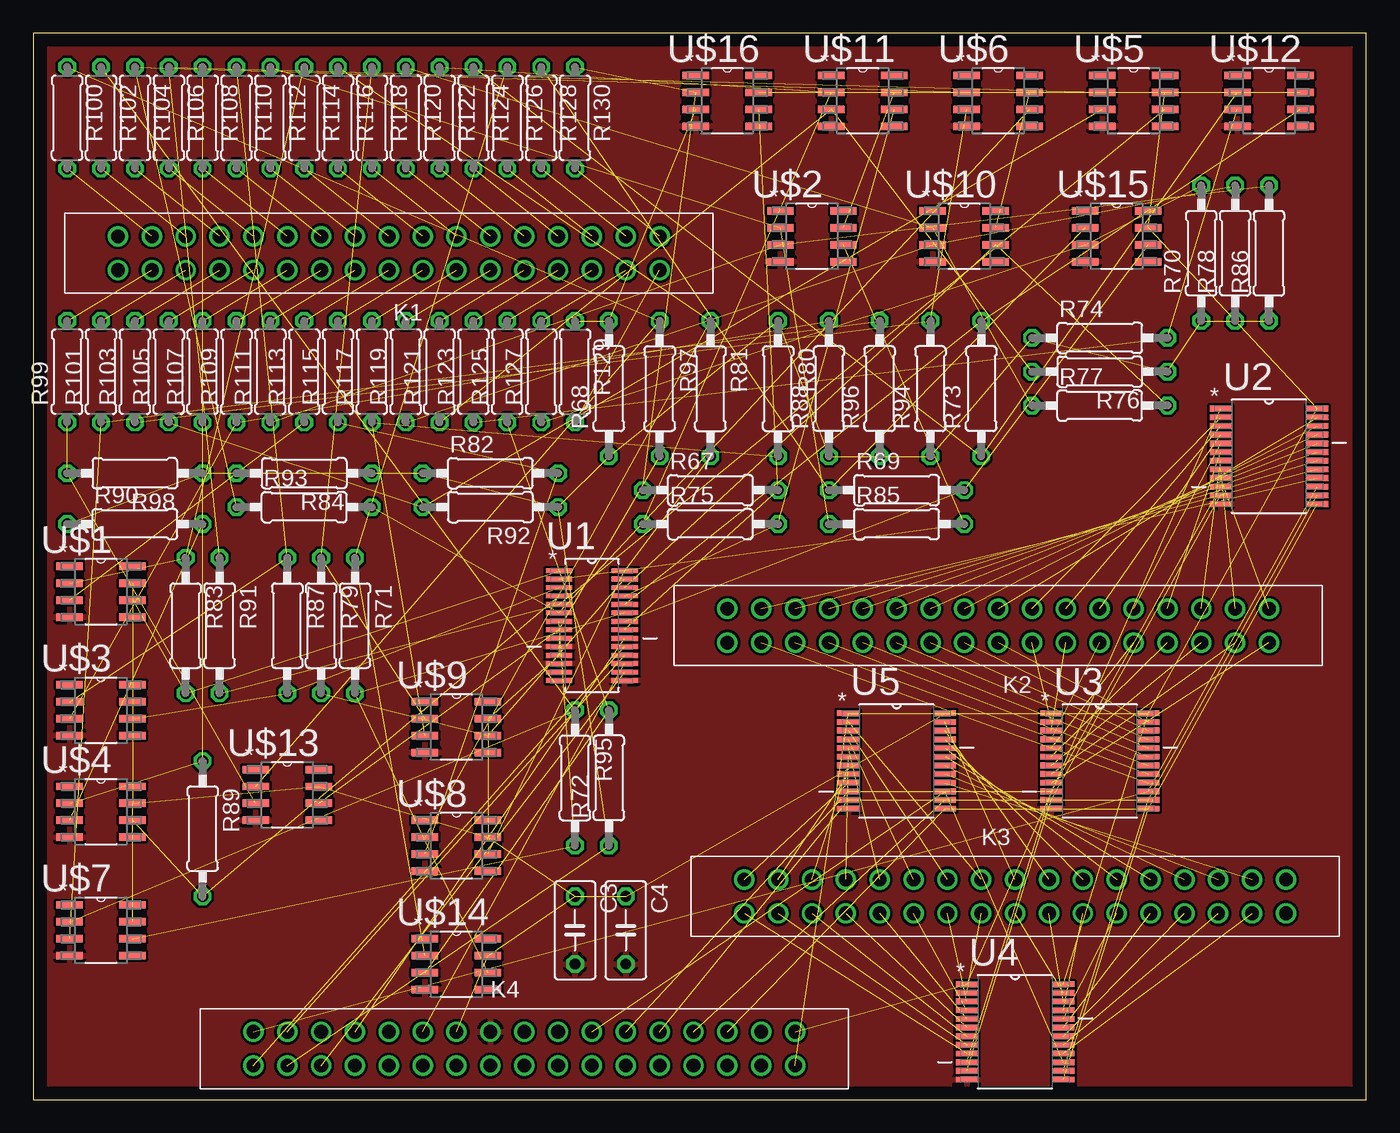
[diagram p8: board, top side]

Size 100 x 80 mm. Coordinates in mm from the lower left corner, seen from the top.
Outline: 0,0 100,0 100,80 0,80 0,0
Copper layers (1*16): Top 0.035mm / dielectric 1.5mm / Bottom 0.035mm
Design rules "default": minimum track width 10mil, minimum drill 24mil, track to track 8mil, track to pad 8mil, pad to pad 8mil, via to via 8mil, smd to smd 8mil, copper to edge 40mil, drill to drill 8mil, minimum pad ring 10mil, minimum via ring 8mil, stop-mask expansion 4mil, vias tented up to drill 0mil, thermal gap 10mil

### Footprints (pad centres in the part's own frame; a part is rotated, then mirrored left to right if it is on the bottom)
C050-030X075 = drill 0.813 octagon: 1 -2.54,0; 2 2.54,0
61203422323 = drill 1.02: 1 -2.54,-1.27; 2 -2.54,1.27; 3 0,-1.27; 4 0,1.27; 5 2.54,-1.27; 6 2.54,1.27; 7 5.08,-1.27; 8 5.08,1.27; 9 7.62,-1.27; 10 7.62,1.27; 11 10.16,-1.27; 12 10.16,1.27; 13 12.7,-1.27; 14 12.7,1.27; 15 15.24,-1.27; 16 15.24,1.27; 17 17.78,-1.27; 18 17.78,1.27; 19 20.32,-1.27; 20 20.32,1.27; 21 22.86,-1.27; 22 22.86,1.27; 23 25.4,-1.27; 24 25.4,1.27; 25 27.94,-1.27; 26 27.94,1.27; 27 30.48,-1.27; 28 30.48,1.27; 29 33.02,-1.27; 30 33.02,1.27; 31 35.56,-1.27; 32 35.56,1.27; 33 38.1,-1.27; 34 38.1,1.27
0207/10 = drill 0.813 octagon: 1 -5.08,0; 2 5.08,0
0207/7 = drill 0.813 octagon: 1 -3.81,0; 2 3.81,0
SOP63P600X175-28N = smd 1.981 x 0.356: 1 -2.464,4.115; 2 -2.464,3.505; 3 -2.464,2.845; 4 -2.464,2.235; 5 -2.464,1.575; 6 -2.464,0.965; 7 -2.464,0.305; 8 -2.464,-0.305; 9 -2.464,-0.965; 10 -2.464,-1.575; 11 -2.464,-2.235; 12 -2.464,-2.845; 13 -2.464,-3.505; 14 -2.464,-4.115; 15 2.464,-4.115; 16 2.464,-3.505; 17 2.464,-2.845; 18 2.464,-2.235; 19 2.464,-1.575; 20 2.464,-0.965; 21 2.464,-0.305; 22 2.464,0.305; 23 2.464,0.965; 24 2.464,1.575; 25 2.464,2.235; 26 2.464,2.845; 27 2.464,3.505; 28 2.464,4.115
SOP65P780X200-24N = smd 1.651 x 0.432: 1 -3.632,3.581; 2 -3.632,2.921; 3 -3.632,2.286; 4 -3.632,1.626; 5 -3.632,0.965; 6 -3.632,0.33; 7 -3.632,-0.33; 8 -3.632,-0.965; 9 -3.632,-1.626; 10 -3.632,-2.286; 11 -3.632,-2.921; 12 -3.632,-3.581; 13 3.632,-3.581; 14 3.632,-2.921; 15 3.632,-2.286; 16 3.632,-1.626; 17 3.632,-0.965; 18 3.632,-0.33; 19 3.632,0.33; 20 3.632,0.965; 21 3.632,1.626; 22 3.632,2.286; 23 3.632,2.921; 24 3.632,3.581
SOIC127P600X175-8N = smd 1.981 x 0.559: 1 -2.362,1.905; 2 -2.362,0.635; 3 -2.362,-0.635; 4 -2.362,-1.905; 5 2.362,-1.905; 6 2.362,-0.635; 7 2.362,0.635; 8 2.362,1.905

### Placement (x,y rotation side)
C3  40.64,12.7 270 top
C4  44.45,12.7 270 top
K1  44.45,63.5 180 top
K2  90.17,35.56 180 top
K3  55.88,15.24 0 top
K4  19.05,3.81 0 top
R67  50.8,45.72 0 top
R68  43.18,53.34 90 top
R69  64.77,45.72 0 top
R70  87.63,63.5 90 top
R71  24.13,35.56 270 top
R72  43.18,24.13 90 top
R73  71.12,53.34 90 top
R74  80.01,57.15 0 top
R75  50.8,43.18 0 top
R76  80.01,54.61 180 top
R77  80.01,52.07 0 top
R78  90.17,63.5 90 top
R79  21.59,35.56 270 top
R80  55.88,53.34 270 top
R81  50.8,53.34 270 top
R82  34.29,46.99 0 top
R83  11.43,35.56 270 top
R84  20.32,46.99 180 top
R85  64.77,43.18 0 top
R86  92.71,63.5 90 top
R87  19.05,35.56 270 top
R88  59.69,53.34 90 top
R89  12.7,20.32 270 top
R90  7.62,43.18 0 top
R91  13.97,35.56 270 top
R92  34.29,44.45 180 top
R93  20.32,44.45 0 top
R94  67.31,53.34 90 top
R95  40.64,24.13 270 top
R96  63.5,53.34 90 top
R97  46.99,53.34 270 top
R98  7.62,46.99 180 top
R99  2.54,54.61 90 top
R100  2.54,73.66 270 top
R101  5.08,54.61 90 top
R102  5.08,73.66 270 top
R103  7.62,54.61 90 top
R104  7.62,73.66 270 top
R105  10.16,54.61 90 top
R106  10.16,73.66 270 top
R107  12.7,54.61 90 top
R108  12.7,73.66 270 top
R109  15.24,54.61 90 top
R110  15.24,73.66 270 top
R111  17.78,54.61 90 top
R112  17.78,73.66 270 top
R113  20.32,54.61 90 top
R114  20.32,73.66 270 top
R115  22.86,54.61 90 top
R116  22.86,73.66 270 top
R117  25.4,54.61 90 top
R118  25.4,73.66 270 top
R119  27.94,54.61 90 top
R120  27.94,73.66 270 top
R121  30.48,54.61 90 top
R122  30.48,73.66 270 top
R123  33.02,54.61 90 top
R124  33.02,73.66 270 top
R125  35.56,54.61 90 top
R126  35.56,73.66 270 top
R127  38.1,54.61 90 top
R128  38.1,73.66 270 top
R129  40.64,54.61 270 top
R130  40.64,73.66 270 top
U1  41.91,35.56 0 top
U2  92.71,48.26 0 top
U3  80.01,25.4 0 top
U4  73.66,5.08 0 top
U5  64.77,25.4 0 top
U$1  5.08,38.1 0 top
U$2  58.42,64.77 0 top
U$3  5.08,29.21 0 top
U$4  5.08,21.59 0 top
U$5  82.55,74.93 0 top
U$6  72.39,74.93 0 top
U$7  5.08,12.7 0 top
U$8  31.75,19.05 0 top
U$9  31.75,27.94 0 top
U$10  69.85,64.77 0 top
U$11  62.23,74.93 0 top
U$12  92.71,74.93 0 top
U$13  19.05,22.86 0 top
U$14  31.75,10.16 0 top
U$15  81.28,64.77 0 top
U$16  52.07,74.93 0 top

### Tracks (layer width: path | path; a pad name or v marks a point on that pad's centre or on a via)
GND
  pour Top: -1.27,81.28 101.6,81.28 101.6,-1.27 -1.27,-1.27
N$1  (2 unrouted)
N$3  (2 unrouted)
N$4  (2 unrouted)
N$5  (2 unrouted)
N$6  (2 unrouted)
N$7  (2 unrouted)
N$8  (2 unrouted)
N$9  (2 unrouted)
N$10  (2 unrouted)
N$11  (2 unrouted)
N$12  (2 unrouted)
N$13  (2 unrouted)
N$14  (2 unrouted)
N$15  (2 unrouted)
N$16  (2 unrouted)
N$17  (16 unrouted)
N$18  (2 unrouted)
N$19  (2 unrouted)
N$20  (2 unrouted)
N$21  (2 unrouted)
N$22  (2 unrouted)
N$23  (2 unrouted)
N$24  (2 unrouted)
N$25  (2 unrouted)
N$26  (2 unrouted)
N$27  (2 unrouted)
N$28  (2 unrouted)
N$29  (2 unrouted)
N$30  (2 unrouted)
N$31  (2 unrouted)
N$32  (2 unrouted)
N$33  (2 unrouted)
N$34  (2 unrouted)
N$35  (2 unrouted)
N$36  (2 unrouted)
N$37  (2 unrouted)
N$38  (2 unrouted)
N$39  (2 unrouted)
N$40  (2 unrouted)
N$41  (1 unrouted)
N$42  (2 unrouted)
N$43  (1 unrouted)
N$44  (2 unrouted)
N$45  (1 unrouted)
N$46  (2 unrouted)
N$47  (1 unrouted)
N$48  (2 unrouted)
N$49  (1 unrouted)
N$50  (2 unrouted)
N$51  (1 unrouted)
N$52  (2 unrouted)
N$53  (1 unrouted)
N$54  (2 unrouted)
N$55  (1 unrouted)
N$56  (2 unrouted)
N$57  (1 unrouted)
N$58  (2 unrouted)
N$59  (1 unrouted)
N$60  (1 unrouted)
N$61  (1 unrouted)
N$62  (1 unrouted)
N$63  (1 unrouted)
N$64  (1 unrouted)
N$65  (1 unrouted)
N$66  (1 unrouted)
N$67  (1 unrouted)
N$68  (1 unrouted)
N$69  (1 unrouted)
N$70  (1 unrouted)
N$71  (1 unrouted)
N$72  (1 unrouted)
N$73  (1 unrouted)
N$74  (1 unrouted)
N$75  (1 unrouted)
N$76  (1 unrouted)
N$77  (1 unrouted)
N$78  (1 unrouted)
N$79  (1 unrouted)
N$80  (1 unrouted)
N$81  (1 unrouted)
N$82  (1 unrouted)
N$83  (1 unrouted)
N$84  (1 unrouted)
N$85  (1 unrouted)
N$86  (1 unrouted)
N$87  (1 unrouted)
N$88  (1 unrouted)
N$89  (1 unrouted)
N$90  (1 unrouted)
N$91  (1 unrouted)
N$92  (1 unrouted)
N$93  (1 unrouted)
N$94  (1 unrouted)
N$95  (1 unrouted)
N$96  (1 unrouted)
N$97  (1 unrouted)
N$98  (1 unrouted)
N$99  (1 unrouted)
N$100  (1 unrouted)
N$101  (1 unrouted)
N$102  (1 unrouted)
N$103  (1 unrouted)
N$104  (1 unrouted)
N$105  (1 unrouted)
N$106  (1 unrouted)
N$107  (1 unrouted)
N$108  (1 unrouted)
N$109  (1 unrouted)
N$110  (1 unrouted)
N$111  (1 unrouted)
N$112  (1 unrouted)
N$113  (1 unrouted)
N$114  (1 unrouted)
N$115  (1 unrouted)
N$116  (1 unrouted)
N$117  (1 unrouted)
N$118  (1 unrouted)
N$119  (1 unrouted)
N$120  (1 unrouted)
N$121  (1 unrouted)
N$122  (1 unrouted)
N$123  (1 unrouted)
N$124  (1 unrouted)
N$125  (1 unrouted)
N$126  (1 unrouted)
N$127  (1 unrouted)
N$128  (1 unrouted)
N$129  (1 unrouted)
N$130  (1 unrouted)
N$131  (1 unrouted)
N$132  (1 unrouted)
N$133  (1 unrouted)
N$134  (1 unrouted)
N$135  (1 unrouted)
N$136  (1 unrouted)
N$137  (1 unrouted)
N$138  (1 unrouted)
N$139  (1 unrouted)
N$140  (1 unrouted)
N$141  (1 unrouted)
N$142  (1 unrouted)
N$143  (1 unrouted)
N$144  (1 unrouted)
N$145  (1 unrouted)
N$146  (1 unrouted)
N$147  (1 unrouted)
N$148  (1 unrouted)
N$149  (1 unrouted)
N$151  (4 unrouted)
N$152  (2 unrouted)
N$153  (1 unrouted)
N$154  (2 unrouted)
N$155  (4 unrouted)
N$156  (4 unrouted)
N$157  (2 unrouted)
N$160  (2 unrouted)
N$161  (2 unrouted)
N$162  (4 unrouted)
VCC  (24 unrouted)